# Altium project MS_1_MainBoard.PrjPCB
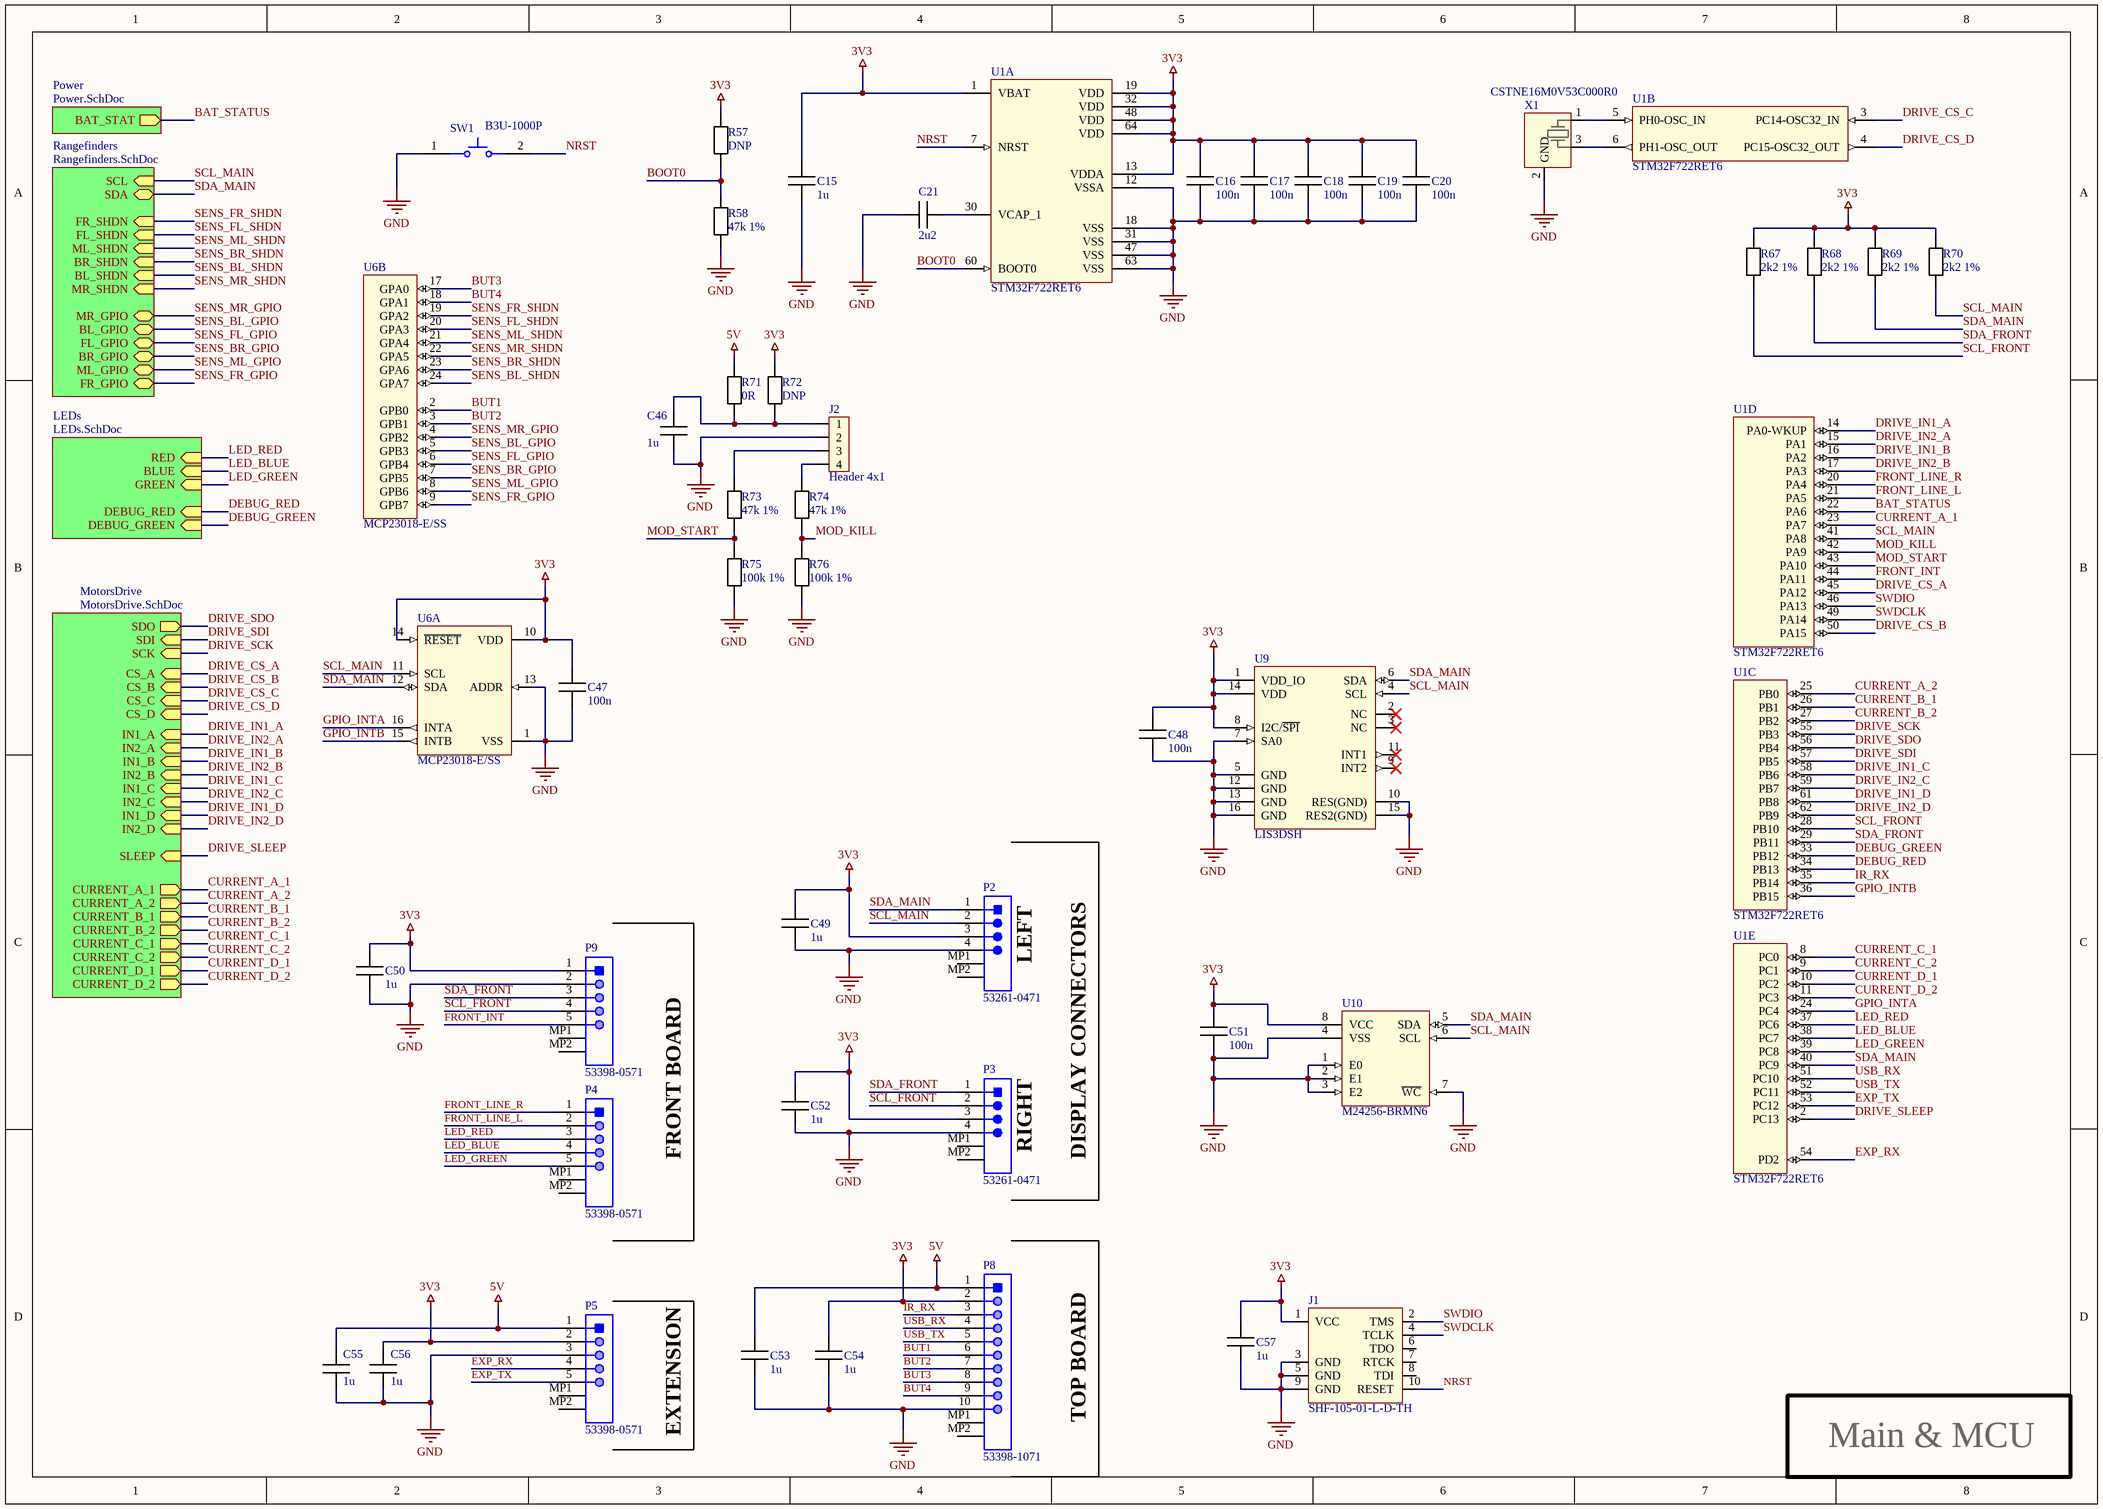
[diagram p0: Main.SchDoc]
6 sheets, 239 parts. Net scope: hierarchical (ports join the sheet entries above them; power ports are global).
Board file: MS_1_MainBoard.PcbDoc
Sheets:
  Main.SchDoc
    Rangefinders = Rangefinders.SchDoc
    Power = Power.SchDoc
    MotorsDrive = MotorsDrive.SchDoc
      VoltageBuffers = VoltageBuffers.SchDoc
    LEDs = LEDs.SchDoc

## Sheet Main.SchDoc: [Untitled]
size A3; Author: Nędzny Janusz; CompanyName: SensDx S.A.; Organization: SensDx S.A.; Address1: Wrocław Laboratories; SheetNumber: 1; SheetTotal: 1

### Parts
C15  1u  [C_0603_AUTO]
C16  100n  [C_0603_AUTO]
C17  100n  [C_0603_AUTO]
C18  100n  [C_0603_AUTO]
C19  100n  [C_0603_AUTO]
C20  100n  [C_0603_AUTO]
C21  2u2  [C_0603_AUTO]
C46  1u  [C_0603_AUTO]
C47  100n  [C_0603_AUTO]
C48  100n  [C_0603_AUTO]
C49  1u  [C_0603_AUTO]
C50  1u  [C_0603_AUTO]
C51  100n  [C_0603_AUTO]
C52  1u  [C_0603_AUTO]
C53  1u  [C_0603_AUTO]
C54  1u  [C_0603_AUTO]
C55  1u  [C_0603_AUTO]
C56  1u  [C_0603_AUTO]
C57  1u  [C_0603_AUTO]
J1  SHF-105-01-L-D-TH  [SHF-105-01-L-D-TH]
J2  Header 4x1  [F_4X1_254]
P2  53261-0471  [MOLEX-53261-0471_V]
P3  53261-0471  [MOLEX-53261-0471_V]
P4  53398-0571  [MOLX-53398-0571-5_V]
P5  53398-0571  [MOLX-53398-0571-5_V]
P8  53398-1071  [MOLX-53398-1071_V]
P9  53398-0571  [MOLX-53398-0571-5_V]
R57  DNP  [R_0603_AUTO]
R58  47k 1%  [R_0603_AUTO]
R67  2k2 1%  [R_0603_AUTO]
R68  2k2 1%  [R_0603_AUTO]
R69  2k2 1%  [R_0603_AUTO]
R70  2k2 1%  [R_0603_AUTO]
R71  0R  [R_0603_AUTO]
R72  DNP  [R_0603_AUTO]
R73  47k 1%  [R_0603_AUTO]
R74  47k 1%  [R_0603_AUTO]
R75  100k 1%  [R_0603_AUTO]
R76  100k 1%  [R_0603_AUTO]
SW1  B3U-1000P  [OMRON-B3U-1000_V]
U1  STM32F722RET6  [LQFP_64_HAND]  (parts A,B,C,D,E of 5)
U6  MCP23018-E/SS  [SSOP-24_HAND]  (parts A,B of 2)
U9  LIS3DSH  [LGA16_AUTO]
U10  M24256-BRMN6  [SOIC_8_AUTO]
X1  CSTNE16M0V53C000R0  [Murata_CSTCE]

### Sub-sheets
LEDs = LEDs.SchDoc: RED (in), BLUE (in), GREEN (in), DEBUG_RED (in), DEBUG_GREEN (in)
MotorsDrive = MotorsDrive.SchDoc: IN1_C (in), IN2_D (in), SLEEP (in), IN2_B (in), IN1_D (in), SDO (out), SCK (in), CS_D (in), SDI (in), CS_C (in), IN2_A (in), IN1_A (in), IN1_B (in), CS_B (in), IN2_C (in), CS_A (in), CURRENT_D_2 (out), CURRENT_D_1 (out), CURRENT_C_1 (out), CURRENT_B_2 (out), CURRENT_C_2 (out), CURRENT_A_2 (out), CURRENT_A_1 (out), CURRENT_B_1 (out)
Power = Power.SchDoc: BAT_STAT (out)
Rangefinders = Rangefinders.SchDoc: FR_SHDN (in), FR_GPIO (bidir), SCL (in), FL_SHDN (in), SDA (bidir), BL_GPIO (bidir), MR_GPIO (bidir), FL_GPIO (bidir), ML_SHDN (in), BR_SHDN (in), BR_GPIO (bidir), BL_SHDN (in), ML_GPIO (bidir), MR_SHDN (in)

### Nets
3V3: C15.2 C16.2 C17.2 C18.2 C19.2 C20.2 C47.2 C48.2 C49.2 C50.2 C51.2 C52.2 C54.2 C56.2 C57.2 J1.1(VCC) P2.3 P3.3 P5.2 P8.2 P9.1 R57.2 R67.2 R68.2 R69.2 R70.2 R72.2 U1.1(VBAT) U1.13(VDDA) U1.19(VDD) U1.32(VDD) U1.48(VDD) U1.64(VDD) U6.10(VDD) U6.14(~{RESET}) U9.1(VDD_IO) U9.8(I2C/~{SPI}) U9.14(VDD) U10.8(VCC)
5V: C53.2 C55.2 P5.1 P8.1 R71.2
GND: C15.1 C16.1 C17.1 C18.1 C19.1 C20.1 C21.2 C46.1 C47.1 C48.1 C49.1 C50.1 C51.1 C52.1 C53.1 C54.1 C55.1 C56.1 C57.1 J1.3(GND) J1.5(GND) J1.9(GND) J2.2 P2.4 P3.4 P5.3 P8.10 P9.2 R58.1 R75.1 R76.1 SW1.1 U1.12(VSSA) U1.18(VSS) U1.31(VSS) U1.47(VSS) U1.63(VSS) U6.1(VSS) U6.13(ADDR) U9.5(GND) U9.7(SA0) U9.10(RES(GND)) U9.12(GND) U9.13(GND) U9.15(RES2(GND)) U9.16(GND) U10.1(E0) U10.2(E1) U10.3(E2) U10.4(VSS) U10.7(~{WC}) X1.2(GND)
BAT_STATUS: U1.22(PA6) ; sheet Power/BAT_STAT
BOOT0: R57.1 R58.2 U1.60(BOOT0)
BUT1: P8.6 U6.2(GPB0)
BUT2: P8.7 U6.3(GPB1)
BUT3: P8.8 U6.17(GPA0)
BUT4: P8.9 U6.18(GPA1)
CURRENT_A_1: U1.23(PA7) ; sheet MotorsDrive/CURRENT_A_1
CURRENT_A_2: U1.25(PB0) ; sheet MotorsDrive/CURRENT_A_2
CURRENT_B_1: U1.26(PB1) ; sheet MotorsDrive/CURRENT_B_1
CURRENT_B_2: U1.27(PB2) ; sheet MotorsDrive/CURRENT_B_2
CURRENT_C_1: U1.8(PC0) ; sheet MotorsDrive/CURRENT_C_1
CURRENT_C_2: U1.9(PC1) ; sheet MotorsDrive/CURRENT_C_2
CURRENT_D_1: U1.10(PC2) ; sheet MotorsDrive/CURRENT_D_1
CURRENT_D_2: U1.11(PC3) ; sheet MotorsDrive/CURRENT_D_2
DEBUG_GREEN: U1.33(PB12) ; sheet LEDs/DEBUG_GREEN
DEBUG_RED: U1.34(PB13) ; sheet LEDs/DEBUG_RED
DRIVE_CS_A: U1.45(PA12) ; sheet MotorsDrive/CS_A
DRIVE_CS_B: U1.50(PA15) ; sheet MotorsDrive/CS_B
DRIVE_CS_C: U1.3(PC14-OSC32_IN) ; sheet MotorsDrive/CS_C
DRIVE_CS_D: U1.4(PC15-OSC32_OUT) ; sheet MotorsDrive/CS_D
DRIVE_IN1_A: U1.14(PA0-WKUP) ; sheet MotorsDrive/IN1_A
DRIVE_IN1_B: U1.16(PA2) ; sheet MotorsDrive/IN1_B
DRIVE_IN1_C: U1.58(PB6) ; sheet MotorsDrive/IN1_C
DRIVE_IN1_D: U1.61(PB8) ; sheet MotorsDrive/IN1_D
DRIVE_IN2_A: U1.15(PA1) ; sheet MotorsDrive/IN2_A
DRIVE_IN2_B: U1.17(PA3) ; sheet MotorsDrive/IN2_B
DRIVE_IN2_C: U1.59(PB7) ; sheet MotorsDrive/IN2_C
DRIVE_IN2_D: U1.62(PB9) ; sheet MotorsDrive/IN2_D
DRIVE_SCK: U1.55(PB3) ; sheet MotorsDrive/SCK
DRIVE_SDI: U1.57(PB5) ; sheet MotorsDrive/SDI
DRIVE_SDO: U1.56(PB4) ; sheet MotorsDrive/SDO
DRIVE_SLEEP: U1.2(PC13) ; sheet MotorsDrive/SLEEP
EXP_RX: P5.4 U1.54(PD2)
EXP_TX: P5.5 U1.53(PC12)
FRONT_INT: P9.5 U1.44(PA11)
FRONT_LINE_L: P4.2 U1.21(PA5)
FRONT_LINE_R: P4.1 U1.20(PA4)
GPIO_INTA: U1.24(PC4) U6.16(INTA)
GPIO_INTB: U1.36(PB15) U6.15(INTB)
IR_RX: P8.3 U1.35(PB14)
LED_BLUE: P4.4 U1.38(PC7) ; sheet LEDs/BLUE
LED_GREEN: P4.5 U1.39(PC8) ; sheet LEDs/GREEN
LED_RED: P4.3 U1.37(PC6) ; sheet LEDs/RED
MOD_KILL: R74.1 R76.2 U1.42(PA9)
MOD_START: R73.1 R75.2 U1.43(PA10)
NRST: J1.10(RESET) SW1.2 U1.7(NRST)
SCL_FRONT: P3.2 P9.4 R67.1 U1.28(PB10)
SCL_MAIN: P2.2 R70.1 U1.41(PA8) U6.11(SCL) U9.4(SCL) U10.6(SCL) ; sheet Rangefinders/SCL  [project net SCL]
SDA_FRONT: P3.1 P9.3 R68.1 U1.29(PB11)
SDA_MAIN: P2.1 R69.1 U1.40(PC9) U6.12(SDA) U9.6(SDA) U10.5(SDA) ; sheet Rangefinders/SDA  [project net SDA]
SENS_BL_GPIO: U6.5(GPB3) ; sheet Rangefinders/BL_GPIO
SENS_BL_SHDN: U6.24(GPA7) ; sheet Rangefinders/BL_SHDN
SENS_BR_GPIO: U6.7(GPB5) ; sheet Rangefinders/BR_GPIO
SENS_BR_SHDN: U6.23(GPA6) ; sheet Rangefinders/BR_SHDN
SENS_FL_GPIO: U6.6(GPB4) ; sheet Rangefinders/FL_GPIO
SENS_FL_SHDN: U6.20(GPA3) ; sheet Rangefinders/FL_SHDN
SENS_FR_GPIO: U6.9(GPB7) ; sheet Rangefinders/FR_GPIO
SENS_FR_SHDN: U6.19(GPA2) ; sheet Rangefinders/FR_SHDN
SENS_ML_GPIO: U6.8(GPB6) ; sheet Rangefinders/ML_GPIO
SENS_ML_SHDN: U6.21(GPA4) ; sheet Rangefinders/ML_SHDN
SENS_MR_GPIO: U6.4(GPB2) ; sheet Rangefinders/MR_GPIO
SENS_MR_SHDN: U6.22(GPA5) ; sheet Rangefinders/MR_SHDN
SWDCLK: J1.4(TCLK) U1.49(PA14)
SWDIO: J1.2(TMS) U1.46(PA13)
USB_RX: P8.4 U1.51(PC10)
USB_TX: P8.5 U1.52(PC11)
NetC21_1: C21.1 U1.30(VCAP_1)
NetC46_2: C46.2 J2.1 R71.1 R72.1
NetJ2_3: J2.3 R73.2
NetJ2_4: J2.4 R74.2
NetU1_5: U1.5(PH0-OSC_IN) X1.1
NetU1_6: U1.6(PH1-OSC_OUT) X1.3

Not connected (* = marked no-connect by the designer): J1 6(TDO) 7(RTCK) 8(TDI); P2 MP1 MP2; P3 MP1 MP2; P4 MP1 MP2; P5 MP1 MP2; P8 MP1 MP2; P9 MP1 MP2; U9 2(NC)* 3(NC)* 9(INT2)* 11(INT1)*

### Notes on the sheet
- (near P2) LEFT
- FRONT BOARD
- (near P3) RIGHT
- DISPLAY CONNECTORS
- EXTENSION
- TOP BOARD
- Main & MCU
- Title
- Size:
- Date:
- A3
- Number:
- Time:
- Revision:
- Sheet
- of
- File:

### Library data of the parts
C15-C21 C46-C57 = Capacitor: Manufacturer: [Generic]; MPN: [Generic]
  C15 C46 C49 C50 C52-C57: Value: 1u
  C16-C20 C47 C48 C51: Value: 100n
  C21: Value: 2u2
J1 = JTAG_ARM_MINI_10_PIN: Standard ARM 20 pin JTAG connector. Angle 90 deg.; Manufacturer: Samtec; Value: NA; MPN: SHF-105-01-L-D-TH; Supplier 1: Farnell; Supplier 2: Mouser; Supplier 3: Digi-Key; Supplier Part Number 1: 2308450; Supplier Part Number 2: 200-SHF10501LDTH; Supplier Part Number 3: SHF-105-01-L-D-TH-ND
J2 = Header 4x1: Manufacturer: NA; Value: NA; MPN: NA
P2 P3 = CMP-2000-05238-1: Male Header, Pitch 1.25 mm, 1 x 4 Position, Height 3.4 mm, -40 to 85 degC, RoHS, Tape and Reel; Current Rating: 1A; Brand: Molex; Number of Positions / Contacts: 4; Pitch: 1.25mm; Voltage Rating: 125V; Mounting Angle: Right; Manufacturer URL: http://www.molex.com/; Factory Pack Quantity: 1000; Housing Material: Thermoplastic; Datasheet URL: http://www.molex.com/pdm_docs/sd/532610471_sd.pdf; Tradename: PicoBlade; Product Type: Headers; Contact Plating: Tin; Contact Material: PhosphorBronze; Package Description: 1.25mm Pitch PicoBlade(TM) Header, Surface Mount, Right Angle, Lead-Free, 4 Circuits; Mounting Style: SMD/SMT; Manufacturer: Molex; Series: 53261; Packaging: Reel; Number of Rows: 1; RoHS: Details; Number of Positions: 4; Product Category: Headers&WireHousings; Datasheet Version: Rev. G, 01/2012; Type: Shrouded; Termination Style: SMD
P4 P5 P9 = CMP-2000-05250-1: Male Header, Pitch 1.25 mm, 1 x 5 Postion, Height 4.7 mm, -40 to 85 degC, RoHS, Tape and Reel; Brand: Molex; Number of Positions: 5Position; Mounting Angle: Vertical; Current Rating: 1A; Pitch: 1.25mm; Voltage Rating: 125V; Type: Shrouded; Tradename: PicoBlade; Datasheet Version: Rev. E, 04/2006; Housing Material: Nylon; Datasheet URL: http://www.molex.com/pdm_docs/sd/533980571_sd.pdf; Termination Style: SMD; Contact Gender: Pin(Male); Factory Pack Quantity: 1000; Number of Rows: 1Row; Product: Headers; Package Reference: MOLX-53398-0571-5; Contact Material: PhosphorBronze; RoHS: Details; Manufacturer URL: http://www.molex.com/; Product Category: Headers&WireHousings; Contact Plating: Tin; Manufacturer: Molex; Series: 53398; Packaging: Reel; Mounting Style: SMD
P8 = CMP-2000-05635-1: Male Header, Pitch 1.25 mm, 1 x 10 Position, Height 4.7 mm, -40 to 85 degC, RoHS, Tape and Reel; Manufacturer: Molex; Mounting Angle: Vertical; Pitch: 1.25mm; Voltage Rating: 125V; Current Rating: 1A; Number of Rows: 1Row; Housing Material: Nylon; Mounting Technology: SurfaceMount; Mounting Style: SMD; Contact Material: PhosphorBronze; Product: Headers; Datasheet URL: http://www.molex.com/pdm_docs/sd/533981071_sd.pdf; Manufacturer URL: http://www.molex.com/; Datasheet Version: Rev. J, 09/2015; Factory Pack Quantity: 1000; Brand: Molex; Packaging: Reel; Product Category: Headers&WireHousings; Contact Gender: Pin(Male); Number of Positions: 10Position; RoHS: Details; Contact Plating: Tin; Package Description: Male Header, Pitch 1.25 mm, 1 x 10 Position, Height 4.7 mm; Series: 53398; Type: Shrouded; Package Reference: 53398-1071; Tradename: PicoBlade; Termination Style: SMD
R57 R58 R67-R76 = Resistor: MPN: [Generic]; Manufacturer: [Generic]
  R57 R72: Value: DNP
  R58 R73 R74: Value: 47k 1%
  R67-R70: Value: 2k2 1%
  R71: Value: 0R
  R75 R76: Value: 100k 1%
SW1 = CMP-2100-03586-1: Ultra-Small Tactile Switch, 0.05 A, 12 V, -25 to 70 degC, 2-Pin SMD, RoHS, Tape and Reel; Manufacturer: Omron Electronic Components; Operating Force: 1.5N; Current Rating: 50mA; Voltage Rating (DC): 12V; Electrical Life: 200000Cycles; Actuator Length: 0.4mm; Insulation Resistance: 100MOhm; Switch Travel: 0.15mm; Throw Configuration: SPST; Illumination Type: Illuminated; Width: 3mm; Weight: 0.022g; Datasheet Version: 42005.0; Datasheet URL: http://www.omron.com/ecb/products/pdf/en-b3u.pdf; Height: 1.2mm; Package Quantity: 1; REACH SVHC: Unknown; Contact Current Rating: 50mA; Contact Material: Silver; Max Current Rating: 50mA; Package Reference: B3U-1000; Termination: SMD/SMT; Packaging: TapeandReel; Manufacturer URL: http://www.omron.com/; RoHSCompliant: true; Mount: SurfaceMount; Length: 4mm; Min Operating Temperature: -25degC; Depth: 2.5mm; Lead Free: LeadFree; Case/Package: SMD/SMT; Package Description: 2-Pin Surface Mount Device, Body 3 x 2.5 mm; Max Operating Temperature: 70degC; Orientation: Straight
U1 = STM32F722RET6: ST 32-bit MCU, 64-pin package; Manufacturer: STMicroelectronics; Value: NA; MPN: STM32F722RET6; ComponentLink1Description: Datasheet; ComponentLink1URL: https://www.st.com/resource/en/datasheet/stm32f722re.pdf; ComponentLink4Description: Product page; ComponentLink4URL: https://www.st.com/en/microcontrollers/stm32f722re.html; Supplier 3: Digi-Key; Supplier 2: Mouser; Supplier 1: Farnell; Supplier Part Number 1: 2725144; Supplier Part Number 2: 511-STM32F722RET6; Supplier Part Number 3: 497-17184-ND
U6 = MCP23018-E/SS: Expander I/O, 16-bit, 3.4 MHz, I2C, 1.8 V, 5.5 V, SSOP24; Manufacturer: Microchip; Value: NA; MPN: MCP23018-E/SS; ComponentLink1Description: Datasheet; ComponentLink1URL: http://ww1.microchip.com/downloads/en/DeviceDoc/22103a.pdf; ComponentLink2Description: Product page; ComponentLink2URL: https://www.microchip.com/wwwproducts/en/MCP23018
U9 = LIS3DSH: MEMS digital output motion sensor: / ultra-low-power high-performance three-axis "nano" accelerometer; Manufacturer: STMicroelectronics; Value: NA; MPN: LIS3DSH; ComponentLink1Description: Datasheet; ComponentLink1URL: https://www.st.com/resource/en/datasheet/lis3dsh.pdf; Supplier 1: Farnell; Supplier 2: Digi-Key; Supplier 3: Mouser; Supplier Part Number 1: 2433078; Supplier Part Number 3: 511-LIS3DSH; Supplier Part Number 2: LIS3DSH-ND
U10 = M24256-BRMN6: 256 Kbit Serial I2C Bus EEPROM; Manufacturer: STMicroelectronics; Value: 256kb; MPN: M24256-BRMN6; ComponentLink1Description: Datasheet; ComponentLink1URL: https://www.st.com/resource/en/datasheet/m24256-br.pdf; Supplier 1: Farnell; Supplier 2: Digi-Key; Supplier 3: Mouser; Supplier Part Number 1: 3130145RL; Supplier Part Number 2: 497-6348-2-ND; Supplier Part Number 3: 511-M24256-BRMN6TP
X1 = CSTNE16M0V53C000R0: 16MHz crystal resonator; Manufacturer: Murata; MPN: CSTNE16M0V53C000R0; Value: 16MHz; ComponentLink1Description: Datasheet; ComponentLink1URL: https://www.murata.com/en-global/products/productdata/8801162166302/SPEC-CSTNE16M0V53C000R0.pdf?1559743213000; Supplier 1: Mouser; Supplier 2: Digi-Key; Supplier Part Number 1: 81-CSTNE16M0V53C000R; Supplier Part Number 2: 490-17949-2-ND

## Sheet Rangefinders.SchDoc: [Untitled]
size A3; Author: Nędzny Janusz; CompanyName: SensDx S.A.; Organization: SensDx S.A.; Address1: Wrocław Laboratories; SheetNumber: 1; SheetTotal: 1
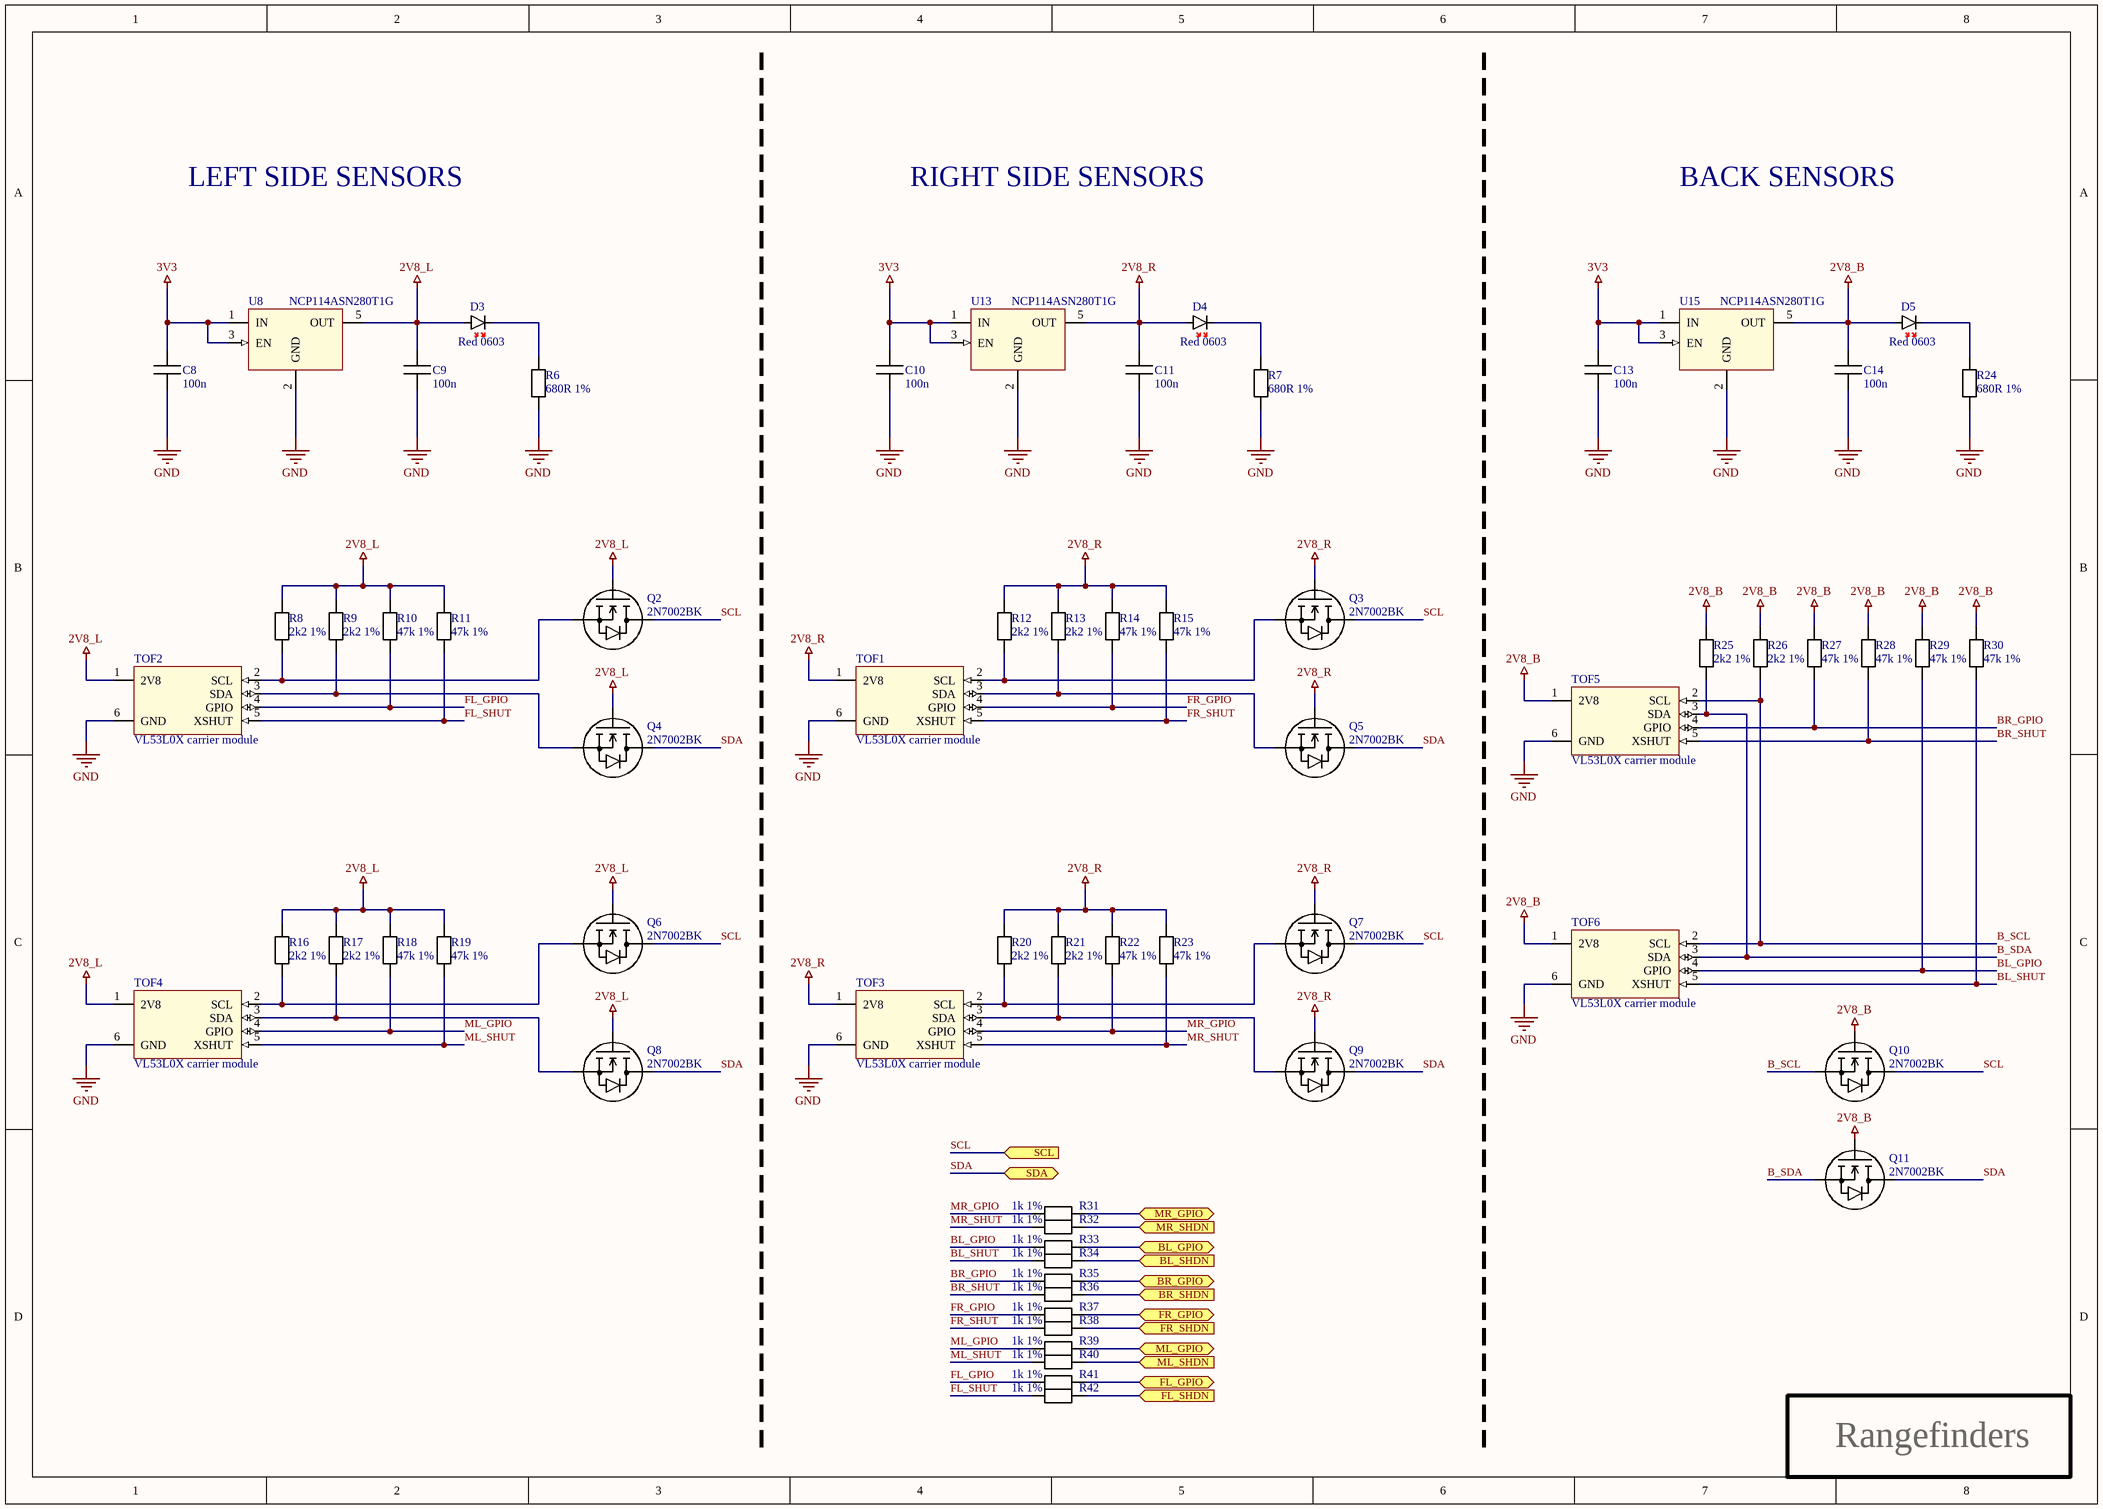
[diagram p1: Rangefinders.SchDoc]

### Parts
C8  100n  [C_0603_AUTO]
C9  100n  [C_0603_AUTO]
C10  100n  [C_0603_AUTO]
C11  100n  [C_0603_AUTO]
C13  100n  [C_0603_AUTO]
C14  100n  [C_0603_AUTO]
D3  Red 0603  [LED_0603_AUTO]
D4  Red 0603  [LED_0603_AUTO]
D5  Red 0603  [LED_0603_AUTO]
Q2  2N7002BK  [SOT23-3_AUTO]
Q3  2N7002BK  [SOT23-3_AUTO]
Q4  2N7002BK  [SOT23-3_AUTO]
Q5  2N7002BK  [SOT23-3_AUTO]
Q6  2N7002BK  [SOT23-3_AUTO]
Q7  2N7002BK  [SOT23-3_AUTO]
Q8  2N7002BK  [SOT23-3_AUTO]
Q9  2N7002BK  [SOT23-3_AUTO]
Q10  2N7002BK  [SOT23-3_AUTO]
Q11  2N7002BK  [SOT23-3_AUTO]
R6  680R 1%  [R_0603_AUTO]
R7  680R 1%  [R_0603_AUTO]
R8  2k2 1%  [R_0603_AUTO]
R9  2k2 1%  [R_0603_AUTO]
R10  47k 1%  [R_0603_AUTO]
R11  47k 1%  [R_0603_AUTO]
R12  2k2 1%  [R_0603_AUTO]
R13  2k2 1%  [R_0603_AUTO]
R14  47k 1%  [R_0603_AUTO]
R15  47k 1%  [R_0603_AUTO]
R16  2k2 1%  [R_0603_AUTO]
R17  2k2 1%  [R_0603_AUTO]
R18  47k 1%  [R_0603_AUTO]
R19  47k 1%  [R_0603_AUTO]
R20  2k2 1%  [R_0603_AUTO]
R21  2k2 1%  [R_0603_AUTO]
R22  47k 1%  [R_0603_AUTO]
R23  47k 1%  [R_0603_AUTO]
R24  680R 1%  [R_0603_AUTO]
R25  2k2 1%  [R_0603_AUTO]
R26  2k2 1%  [R_0603_AUTO]
R27  47k 1%  [R_0603_AUTO]
R28  47k 1%  [R_0603_AUTO]
R29  47k 1%  [R_0603_AUTO]
R30  47k 1%  [R_0603_AUTO]
R31  1k 1%  [R_0603_AUTO]
R32  1k 1%  [R_0603_AUTO]
R33  1k 1%  [R_0603_AUTO]
R34  1k 1%  [R_0603_AUTO]
R35  1k 1%  [R_0603_AUTO]
R36  1k 1%  [R_0603_AUTO]
R37  1k 1%  [R_0603_AUTO]
R38  1k 1%  [R_0603_AUTO]
R39  1k 1%  [R_0603_AUTO]
R40  1k 1%  [R_0603_AUTO]
R41  1k 1%  [R_0603_AUTO]
R42  1k 1%  [R_0603_AUTO]
TOF1  VL53L0X carrier module  [VL53L0X_module]
TOF2  VL53L0X carrier module  [VL53L0X_module]
TOF3  VL53L0X carrier module  [VL53L0X_module]
TOF4  VL53L0X carrier module  [VL53L0X_module]
TOF5  VL53L0X carrier module  [VL53L0X_module]
TOF6  VL53L0X carrier module  [VL53L0X_module]
U8  NCP114ASN280T1G  [TSOP-5_AUTO]
U13  NCP114ASN280T1G  [TSOP-5_AUTO]
U15  NCP114ASN280T1G  [TSOP-5_AUTO]

### Ports
BL_GPIO (bidir), BL_SHDN (in), BR_GPIO (bidir), BR_SHDN (in), FL_GPIO (bidir), FL_SHDN (in), FR_GPIO (bidir), FR_SHDN (in), ML_GPIO (bidir), ML_SHDN (in), MR_GPIO (bidir), MR_SHDN (in), SCL (in), SDA (bidir)

### Nets
2V8_B: C14.2 D5.2(A) Q10.1(G) Q11.1(G) R25.2 R26.2 R27.2 R28.2 R29.2 R30.2 TOF5.1(2V8) TOF6.1(2V8) U15.5(OUT)
2V8_L: C9.2 D3.2(A) Q2.1(G) Q4.1(G) Q6.1(G) Q8.1(G) R8.2 R9.2 R10.2 R11.2 R16.2 R17.2 R18.2 R19.2 TOF2.1(2V8) TOF4.1(2V8) U8.5(OUT)
2V8_R: C11.2 D4.2(A) Q3.1(G) Q5.1(G) Q7.1(G) Q9.1(G) R12.2 R13.2 R14.2 R15.2 R20.2 R21.2 R22.2 R23.2 TOF1.1(2V8) TOF3.1(2V8) U13.5(OUT)
3V3: C8.2 C10.2 C13.2 U8.1(IN) U8.3(EN) U13.1(IN) U13.3(EN) U15.1(IN) U15.3(EN)
GND: C8.1 C9.1 C10.1 C11.1 C13.1 C14.1 R6.1 R7.1 R24.1 TOF1.6(GND) TOF2.6(GND) TOF3.6(GND) TOF4.6(GND) TOF5.6(GND) TOF6.6(GND) U8.2(GND) U13.2(GND) U15.2(GND)
B_SCL: Q10.2(S) R26.1 TOF5.2(SCL) TOF6.2(SCL)
B_SDA: Q11.2(S) R25.1 TOF5.3(SDA) TOF6.3(SDA)
BL_GPIO: R29.1 R33.2 TOF6.4(GPIO)
BL_SHUT: R30.1 R34.2 TOF6.5(XSHUT)
BR_GPIO: R27.1 R35.2 TOF5.4(GPIO)
BR_SHUT: R28.1 R36.2 TOF5.5(XSHUT)
FL_GPIO: R10.1 R41.2 TOF2.4(GPIO)
FL_SHUT: R11.1 R42.2 TOF2.5(XSHUT)
FR_GPIO: R14.1 R37.2 TOF1.4(GPIO)
FR_SHUT: R15.1 R38.2 TOF1.5(XSHUT)
ML_GPIO: R18.1 R39.2 TOF4.4(GPIO)
ML_SHUT: R19.1 R40.2 TOF4.5(XSHUT)
MR_GPIO: R22.1 R31.2 TOF3.4(GPIO)
MR_SHUT: R23.1 R32.2 TOF3.5(XSHUT)
SCL: Q2.3(D) Q3.3(D) Q6.3(D) Q7.3(D) Q10.3(D) ; port SCL
SDA: Q4.3(D) Q5.3(D) Q8.3(D) Q9.3(D) Q11.3(D) ; port SDA
SENS_BL_GPIO: R33.1 ; port BL_GPIO
SENS_BL_SHDN: R34.1 ; port BL_SHDN
SENS_BR_GPIO: R35.1 ; port BR_GPIO
SENS_BR_SHDN: R36.1 ; port BR_SHDN
SENS_FL_GPIO: R41.1 ; port FL_GPIO
SENS_FL_SHDN: R42.1 ; port FL_SHDN
SENS_FR_GPIO: R37.1 ; port FR_GPIO
SENS_FR_SHDN: R38.1 ; port FR_SHDN
SENS_ML_GPIO: R39.1 ; port ML_GPIO
SENS_ML_SHDN: R40.1 ; port ML_SHDN
SENS_MR_GPIO: R31.1 ; port MR_GPIO
SENS_MR_SHDN: R32.1 ; port MR_SHDN
NetD3_1: D3.1(C) R6.2
NetD4_1: D4.1(C) R7.2
NetD5_1: D5.1(C) R24.2
NetQ2_2: Q2.2(S) R8.1 TOF2.2(SCL)
NetQ3_2: Q3.2(S) R12.1 TOF1.2(SCL)
NetQ4_2: Q4.2(S) R9.1 TOF2.3(SDA)
NetQ5_2: Q5.2(S) R13.1 TOF1.3(SDA)
NetQ6_2: Q6.2(S) R16.1 TOF4.2(SCL)
NetQ7_2: Q7.2(S) R20.1 TOF3.2(SCL)
NetQ8_2: Q8.2(S) R17.1 TOF4.3(SDA)
NetQ9_2: Q9.2(S) R21.1 TOF3.3(SDA)

Not connected (* = marked no-connect by the designer): U8 4(NC); U13 4(NC); U15 4(NC)

### Notes on the sheet
- LEFT SIDE SENSORS
- RIGHT SIDE SENSORS
- BACK SENSORS
- Rangefinders
- Title:
- Project name:
- Last modification:
- Author:
- Version control rev.:
- Sheet:
- /
- Sheet size:
- Variant:
- File name:
- A3
- Altium build:

### Library data of the parts
C8-C11 C13 C14 = Capacitor: Manufacturer: [Generic]; MPN: [Generic]; Value: 100n
D3-D5 = LED_Red_0603: Generic Red 0603; MPN: [Generic]; Value: Red; Manufacturer: [Generic]
Q2-Q11 = 2N7002BK: 60 V, 350 mA N-channel Trench MOSFET Vth=1.6V; Manufacturer: Nexperia; Value: NA; MPN: 2N7002BK; ComponentLink1Description: Datasheet; ComponentLink1URL: https://assets.nexperia.com/documents/data-sheet/2N7002BK.pdf; Supplier 1: Mouser; Supplier 2: Digi-Key; Supplier Part Number 1: 771-2N7002BK215; Supplier Part Number 2: 1727-4789-2-ND
R6-R42 = Resistor: MPN: [Generic]; Manufacturer: [Generic]
  R6 R7 R24: Value: 680R 1%
  R8 R9 R12 R13 R16 R17 R20 R21 R25 R26: Value: 2k2 1%
  R10 R11 R14 R15 R18 R19 R22 R23 R27-R30: Value: 47k 1%
  R31-R42: Value: 1k 1%
TOF1-TOF6 = VL53L0X_module: Custom VL53L0X sensor carrier module; Manufacturer: NA; Value: NA; MPN: NA; ComponentLink1Description: Sensor Datasheet; ComponentLink1URL: https://www.st.com/resource/en/datasheet/vl53l0x.pdf; ComponentLink2Description: Sensor product page; ComponentLink2URL: https://www.st.com/en/imaging-and-photonics-solutions/vl53l0x.html
U8 U13 U15 = NCP114ASN280T1G: LDO fixed 2V8 low noise; Manufacturer: ON Semi; Value: NA; MPN: NCP114ASN280T1G; ComponentLink1Description: Datasheet; ComponentLink1URL: http://www.onsemi.com/pub/Collateral/NCP114-D.PDF; Supplier 1: Digi-Key; Supplier 2: Farnell; Supplier 3: Mouser; Supplier Part Number 1: NCP114ASN280T1GOSDKR-ND; Supplier Part Number 3: 863-NCP114ASN280T1G; Supplier Part Number 2: 2677149

## Sheet Power.SchDoc: [Untitled]
size A3; Author: Nędzny Janusz; CompanyName: SensDx S.A.; Organization: SensDx S.A.; Address1: Wrocław Laboratories; SheetNumber: 1; SheetTotal: 1
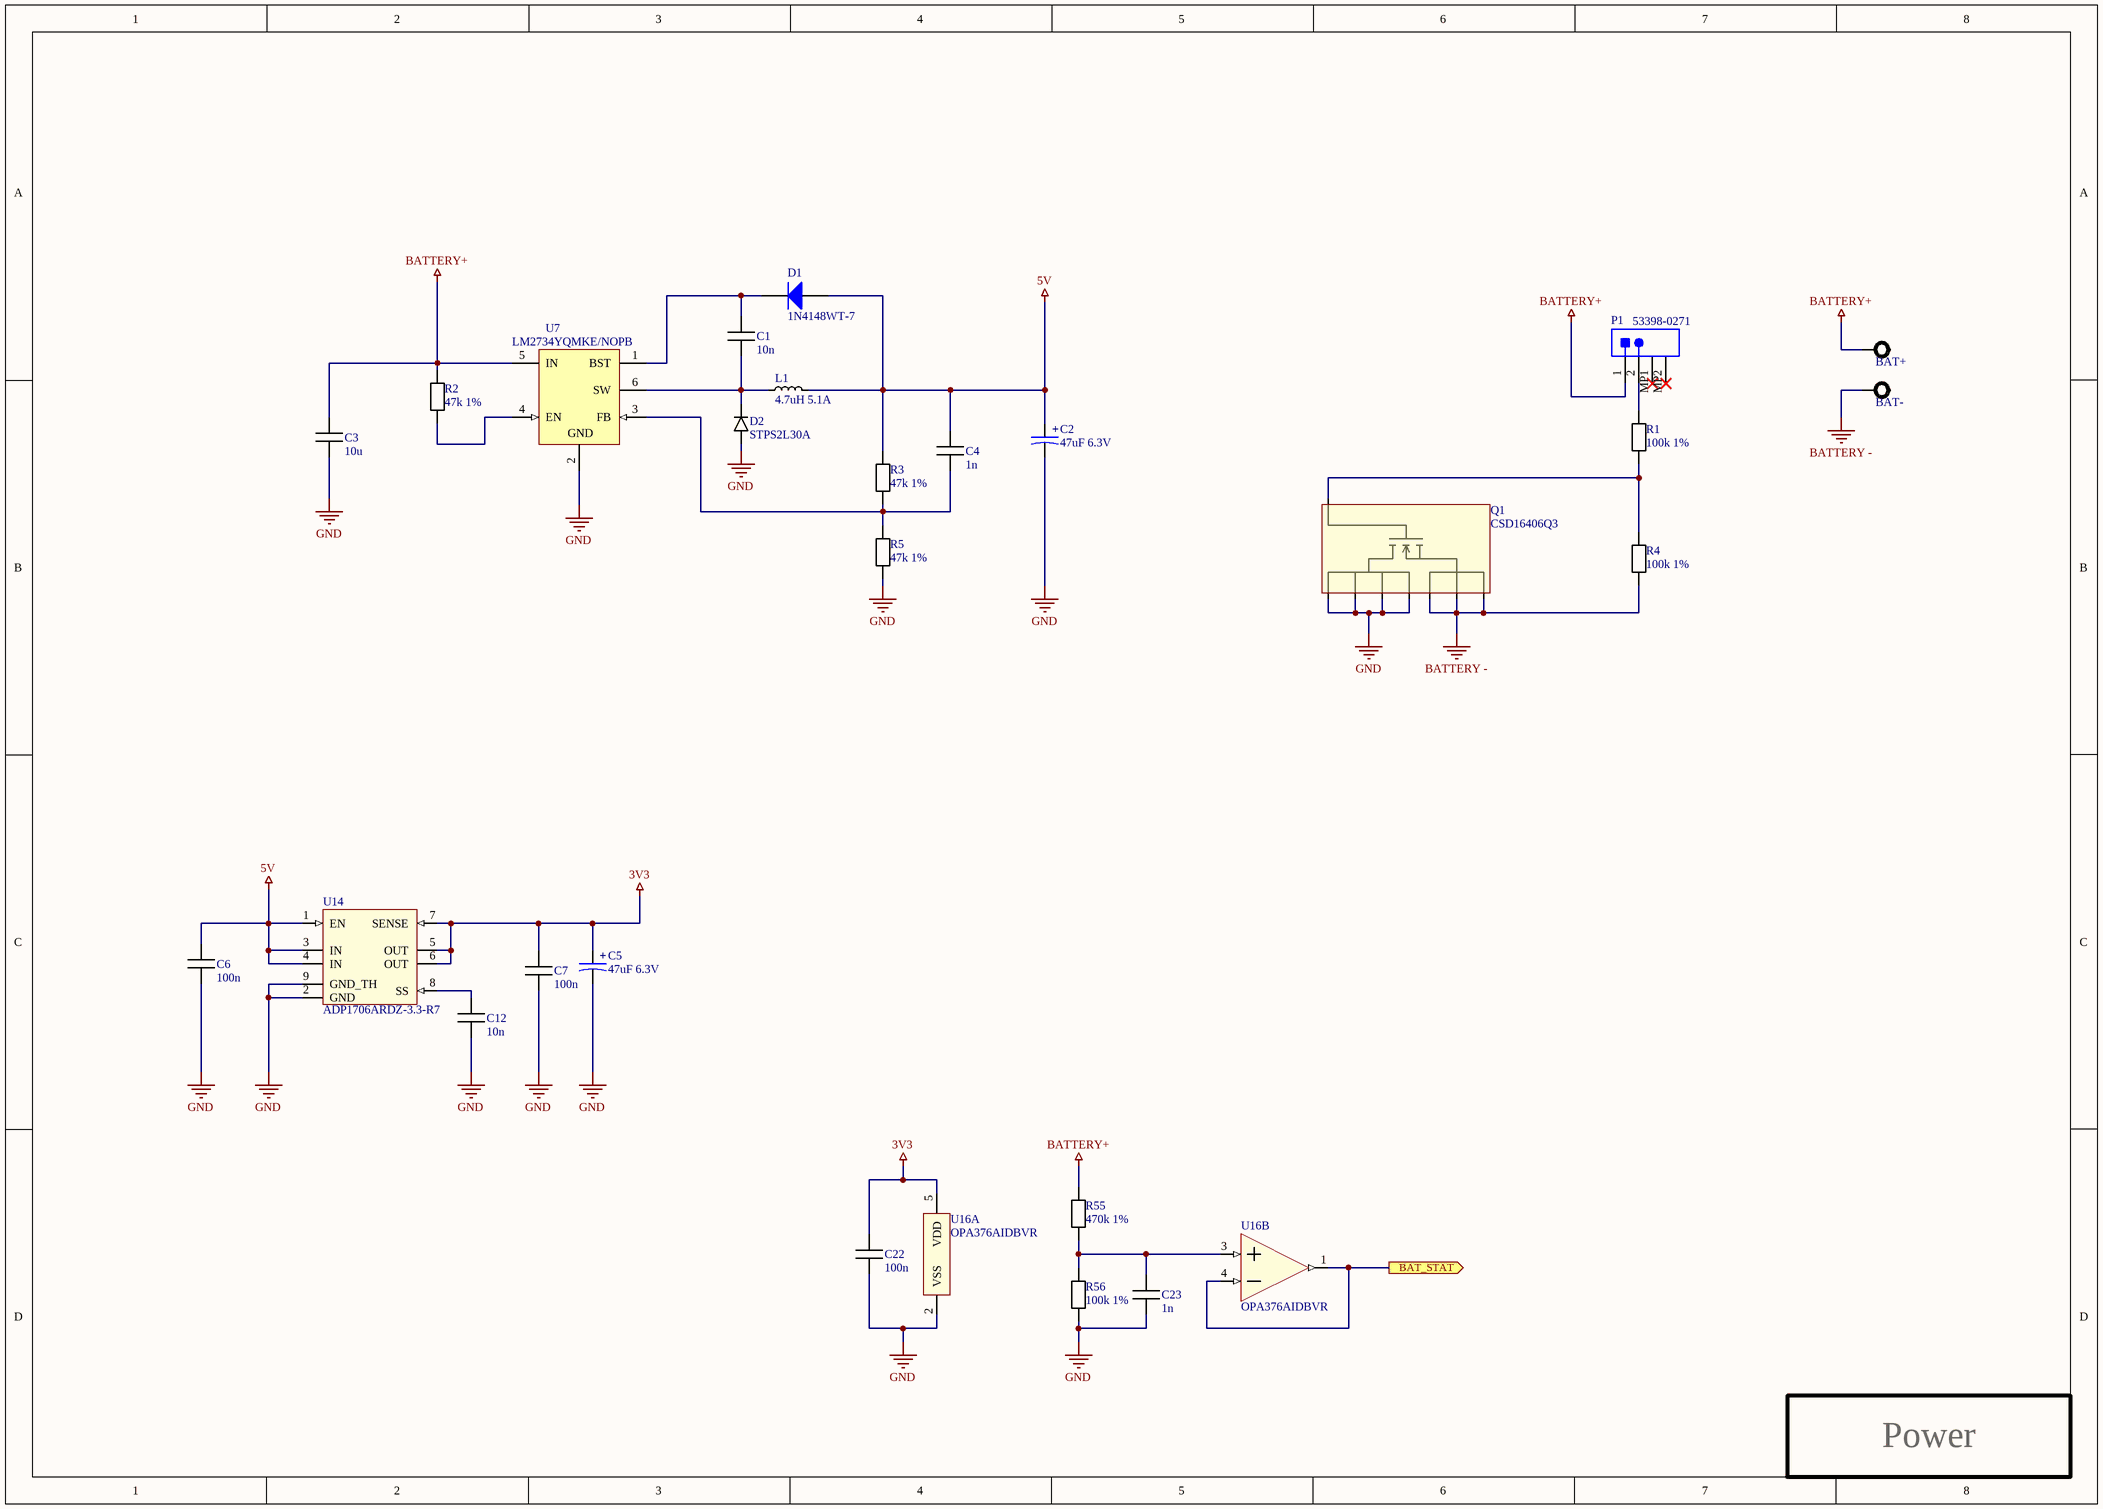
[diagram p2: Power.SchDoc]

### Parts
BAT+  1x2mm  [PAD 1x2mm]  (value not drawn)
BAT-  1x2mm  [PAD 1x2mm]  (value not drawn)
C1  10n  [C_0603_AUTO]
C2  47uF 6.3V  [Kemet_1206]
C3  10u  [C_0805_HAND]
C4  1n  [C_0603_AUTO]
C5  47uF 6.3V  [Kemet_1206]
C6  100n  [C_0603_AUTO]
C7  100n  [C_0603_AUTO]
C12  10n  [C_0603_AUTO]
C22  100n  [C_0603_AUTO]
C23  1n  [C_0603_AUTO]
D1  1N4148WT-7  [DIOD-SOD523-2_V]
D2  STPS2L30A  [SMA]
L1  4.7uH 5.1A  [XAL4030]
P1  53398-0271  [MOLX-53398-0271_V]
Q1  CSD16406Q3  [SON8]
R1  100k 1%  [R_0603_AUTO]
R2  47k 1%  [R_0603_AUTO]
R3  47k 1%  [R_0603_AUTO]
R4  100k 1%  [R_0603_AUTO]
R5  47k 1%  [R_0603_AUTO]
R55  470k 1%  [R_0603_AUTO]
R56  100k 1%  [R_0603_AUTO]
U7  LM2734YQMKE/NOPB  [DDC0006A_L]
U14  ADP1706ARDZ-3.3-R7  [SOIC-8_HAND_THERM]
U16  OPA376AIDBVR  [SOT23-5_AUTO]  (parts A,B of 2)

### Ports
BAT_STAT (out)

### Nets
3V3: C5.1 C7.2 C22.2 U14.5(OUT) U14.6(OUT) U14.7(SENSE) U16.5(VDD)
5V: C2.1 C4.2 C6.2 D1.2(A) L1.2 R3.2 U14.1(EN) U14.3(IN) U14.4(IN)
BATTERY -: BAT-.1 Q1.1(S) Q1.2(S) Q1.3(S) R4.1
BATTERY+: BAT+.1 C3.2 P1.1 R2.2 R55.2 U7.5(IN)
GND: C2.2 C3.1 C5.2 C6.1 C7.1 C12.1 C22.1 C23.1 D2.1(A) Q1.5(S) Q1.6(S) Q1.7(S) Q1.8(S) R5.1 R56.1 U7.2(GND) U14.2(GND) U14.9(GND_TH) U16.2(VSS)
BAT_STATUS: U16.1(OUT) U16.4(IN-) ; port BAT_STAT
NetC1_1: C1.1 D2.2(C) L1.1 U7.6(SW)
NetC1_2: C1.2 D1.1(K) U7.1(BST)
NetC4_1: C4.1 R3.1 R5.2 U7.3(FB)
NetC12_2: C12.2 U14.8(SS)
NetC23_2: C23.2 R55.1 R56.2 U16.3(IN+)
NetP1_2: P1.2 R1.2
NetQ1_4: Q1.4(S) R1.1 R4.2
NetR2_1: R2.1 U7.4(EN)

Not connected (* = marked no-connect by the designer): P1 MP1* MP2*

### Notes on the sheet
- Power
- Title:
- Project name:
- Last modification:
- Author:
- Version control rev.:
- Sheet:
- /
- Sheet size:
- Variant:
- File name:
- A3
- Altium build:
- (in symbol T491A476M006AT) +

### Library data of the parts
BAT+ BAT- = PAD_small: copper pad; Manufacturer: NA; Value: NA; MPN: NA
C1 C3 C4 C6 C7 C12 C22 C23 = Capacitor: Manufacturer: [Generic]; MPN: [Generic]
  C1 C12: Value: 10n
  C3: Value: 10u
  C4 C23: Value: 1n
  C6 C7 C22: Value: 100n
C2 C5 = T491A476M006AT: Tantalum Surface Mount Capacitor, 47 uF, +/- 20%, 6.3 V, -55 to 125 degC, 2-Pin SMD, RoHS, Tape and Reel; Manufacturer: Kemet; Value: 47uF 6.3V; MPN: T491A476M006AT; ComponentLink1Description: Datasheet; ComponentLink1URL: http://www.farnell.com/datasheets/2319567.pdf?_ga=2.178180387.727493313.1541494519-1704470397.1535652464&_gac=1.36309652.1541494519.EAIaIQobChMI6_a5xrK_3gIVxbUYCh3rMw6BEAAYAiAAEgJZGfD_BwE; Supplier 1: Digi-Key; Supplier 2: Mouser; Supplier 3: Farnell; Supplier Part Number 3: 1457429; Supplier Part Number 2: 80-T491A476M06; Supplier Part Number 1: 399-3700-2-ND
D1 = CMP-2000-05518-1: Surface Mount Fast Switching Diode, -65 to 150 degC, 2-Pin SOD523, RoHS, Tape and Reel; Manufacturer: Diodes Inc; Forward Current: 250mA; Diode Configuration: Single; Number of Elements per Chip: 1; Datasheet URL: http://www.diodes.com/_files/datasheets/ds30396.pdf; Pin Count: 2; PartNumber: 1N4148WT; Mounting Type: SurfaceMount; Package Description: 2-Pin Small Outline Diode, Body 1.2 x 0.8 mm; Package URL: http://www.diodes.com/_files/packages/SOD523.pdf; Package Type: SOD-523; Manufacturer URL: http://www.diodes.com/; Datasheet Version: Rev. 16-2, 11/2015; Package Reference: SOD523-2; Mounting Technology: SurfaceMount
D2 = STPS2L30A: Schottky Diodes & Rectifiers 2.0 Amp 30 Volt; Manufacturer: STMicroelectronics; Value: NA; MPN: STPS2L30A; ComponentLink1Description: Datasheet; ComponentLink1URL: https://www.st.com/resource/en/datasheet/stps2l30.pdf; Supplier 1: Digi-Key; Supplier 2: Farnell; Supplier 3: Mouser; Supplier Part Number 2: 1467552; Supplier Part Number 1: 497-3759-2-ND; Supplier Part Number 3: 511-STPS2L30A
L1 = XAL4030-472: Fixed Inductor 4.7uH 20% 5.1A 44.1mOhms; Manufacturer: Coilcraft; Value: 4.7uH 5.1A; MPN: XAL4030-472
P1 = CMP-2000-07600-1: Male Header, Pitch 1.25 mm, 1 x 2 Position, Height 4.7 mm, -40 to 85 degC, RoHS, Tape and Reel; Manufacturer: Molex; Voltage Rating: 125V; Glow Wire Compliant: Non-compliant; Pitch: 1.25mm; Number of Positions: 2; Contact Resistance: 20mOhm; Insulation Resistance: 100MOhm; Current Rating: 1A; Mounting Technology: SurfaceMount; Colour: Natural; Mount: SurfaceMount; Termination: Solder; Packaging: TapeandReel; REACH SVHC: Unknown; Voltage Rating (AC): 125V; Housing Colour: Natural; Manufacturer URL: http://www.molex.com/; Max Operating Temperature: 85degC; Gender: Male; Lead Free: LeadFree; RoHSCompliant: True; Contact Plating: Tin; Package Reference: 53398-0271; Contact Material: Tin; Orientation: Vertical; Datasheet URL: http://www.molex.com/pdm_docs/sd/533980271_sd.pdf; Working Voltage: 125V; Flammability Rating: UL94V-0; Number of Contacts: 2; Package Description: Male Header, Pitch 1.25 mm, 1 x 2 Position, Height 4.7 mm; Datasheet Version: Rev. J, 09/2015; Number of Circuits: 2; Number of Rows: 1; Radiation Hardening: No; Voltage Rating (DC): 125V; Min Operating Temperature: -40degC; Housing Material: Nylon; Package Quantity: 1000
Q1 = CSD16406Q3: N-Channel NexFET™ Power MOSFET; Manufacturer: Texas Instruments; Value: NA; MPN: CSD16406Q3; ComponentLink1Description: Datasheet; ComponentLink1URL: http://www.ti.com/lit/ds/symlink/csd16406q3.pdf; Supplier 1: Digi-Key; Supplier 2: Mouser; Supplier 3: Farnell; Supplier Part Number 1: 296-24251-2-ND; Supplier Part Number 2: 595-CSD16406Q3; Supplier Part Number 3: 2458618
R1-R5 R55 R56 = Resistor: MPN: [Generic]; Manufacturer: [Generic]
  R1 R4 R56: Value: 100k 1%
  R2 R3 R5: Value: 47k 1%
  R55: Value: 470k 1%
U7 = CMP-0063-01059-3: 1A Load Step-Down DC-DC Regulator, 6-pin Tiny SOT23, Pb-Free; Manufacturer: Texas Instruments; PackageTopMarking: SVCB*XTT; PowerWise: N; CompType: MiscPower; Code_IPC: SOT26A-6; RoHS: Y; PackageDescription: Molded TSOT, 2.97 x 1.65 x 0.87mm Body, 6 Lead, 0.95mm Pitch; ComponentLink1URL: http://www.ti.com/general/docs/lit/getliterature.tsp?genericPartNumber=LM2734-Q1&fileType=pdf; PackageReference: DDC0006A; ComponentLink1Description: Datasheet URL; Code_JEDEC: MO-193-AA; PinCount: 6
U14 = ADP1706ARDZ-3.3-R7: LDO 3V3 1A Slow-Start, 450uV RMS noise; Manufacturer: Analog Devices; Value: NA; MPN: ADP1706ARDZ-3.3-R7; Supplier 1: Farnell; Supplier 2: Digi-Key; Supplier 3: Mouser; ComponentLink1Description: Datasheet; ComponentLink1URL: https://www.analog.com/media/en/technical-documentation/data-sheets/ADP1706_1707_1708.pdf; Supplier Part Number 1: 2727463; Supplier Part Number 2: ADP1706ARDZ-3.3-R7TR-ND; Supplier Part Number 3: 584-ADP1706ARDZ3.3R7
U16 = OPA376AIDBVR: OP Amp Single R-R 5-Pin SOT-23 T/R Ultra Low Offset; Manufacturer: Texas Instruments; Value: NA; MPN: OPA376AIDBVR; ComponentLink1Description: Datasheet; ComponentLink1URL: http://www.ti.com/lit/ds/symlink/opa376.pdf

## Sheet MotorsDrive.SchDoc: [Untitled]
size A3; Author: Nędzny Janusz; CompanyName: SensDx S.A.; Organization: SensDx S.A.; Address1: Wrocław Laboratories; SheetNumber: 1; SheetTotal: 1
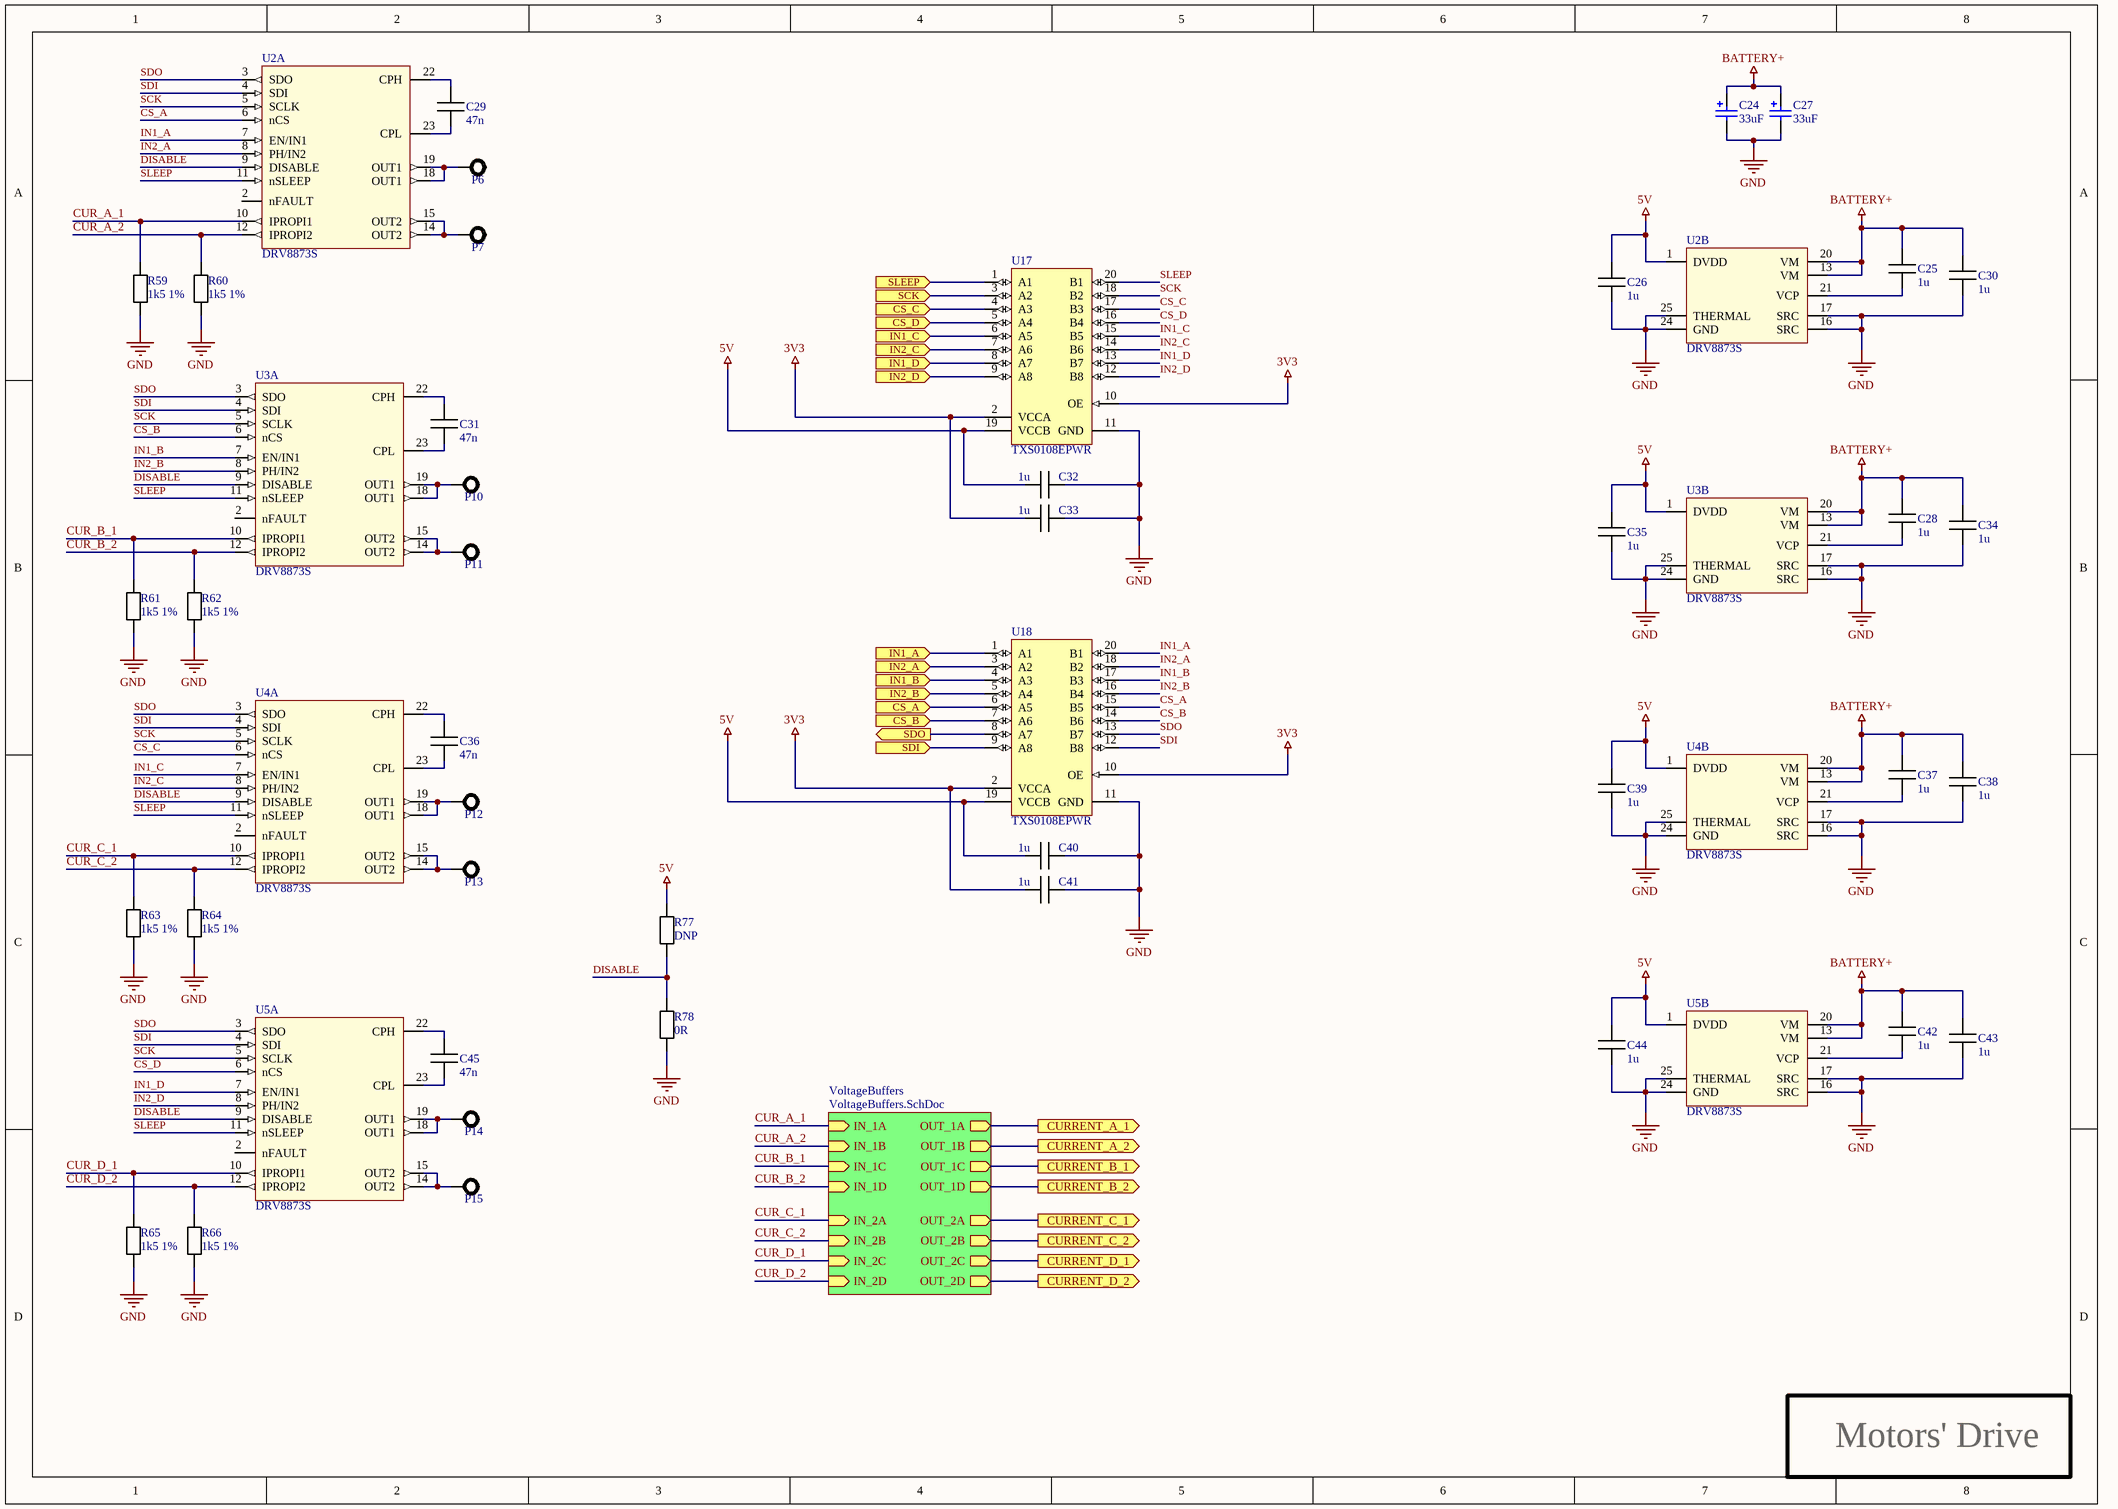
[diagram p3: MotorsDrive.SchDoc]

### Parts
C24  value 33uF  [WCAP-ASLL_6.3x5.5]  (hidden comment: 865060543004)
C25  1u  [C_0603_AUTO]
C26  1u  [C_0603_AUTO]
C27  value 33uF  [WCAP-ASLL_6.3x5.5]  (hidden comment: 865060543004)
C28  1u  [C_0603_AUTO]
C29  47n  [C_0603_AUTO]
C30  1u  [C_0603_AUTO]
C31  47n  [C_0603_AUTO]
C32  1u  [C_0603_AUTO]
C33  1u  [C_0603_AUTO]
C34  1u  [C_0603_AUTO]
C35  1u  [C_0603_AUTO]
C36  47n  [C_0603_AUTO]
C37  1u  [C_0603_AUTO]
C38  1u  [C_0603_AUTO]
C39  1u  [C_0603_AUTO]
C40  1u  [C_0603_AUTO]
C41  1u  [C_0603_AUTO]
C42  1u  [C_0603_AUTO]
C43  1u  [C_0603_AUTO]
C44  1u  [C_0603_AUTO]
C45  47n  [C_0603_AUTO]
P6  1x2mm  [PAD 1x2mm]  (value not drawn)
P7  1x2mm  [PAD 1x2mm]  (value not drawn)
P10  1x2mm  [PAD 1x2mm]  (value not drawn)
P11  1x2mm  [PAD 1x2mm]  (value not drawn)
P12  1x2mm  [PAD 1x2mm]  (value not drawn)
P13  1x2mm  [PAD 1x2mm]  (value not drawn)
P14  1x2mm  [PAD 1x2mm]  (value not drawn)
P15  1x2mm  [PAD 1x2mm]  (value not drawn)
R59  1k5 1%  [R_0603_AUTO]
R60  1k5 1%  [R_0603_AUTO]
R61  1k5 1%  [R_0603_AUTO]
R62  1k5 1%  [R_0603_AUTO]
R63  1k5 1%  [R_0603_AUTO]
R64  1k5 1%  [R_0603_AUTO]
R65  1k5 1%  [R_0603_AUTO]
R66  1k5 1%  [R_0603_AUTO]
R77  DNP  [R_0603_AUTO]
R78  0R  [R_0603_AUTO]
U2  DRV8873S  [SSOP24-TH_HAND]  (parts A,B of 2)
U3  DRV8873S  [SSOP24-TH_HAND]  (parts A,B of 2)
U4  DRV8873S  [SSOP24-TH_HAND]  (parts A,B of 2)
U5  DRV8873S  [SSOP24-TH_HAND]  (parts A,B of 2)
U17  TXS0108EPWR  [PW0020A_M]
U18  TXS0108EPWR  [PW0020A_M]

### Sub-sheets
VoltageBuffers = VoltageBuffers.SchDoc: OUT_1A (out), IN_2A (in), OUT_2D (out), IN_2B (in), OUT_1D (out), IN_1B (in), IN_1C (in), IN_1D (in), OUT_1B (out), OUT_2C (out), OUT_2B (out), IN_2D (in), IN_1A (in), OUT_1C (out), IN_2C (in), OUT_2A (out)

### Ports
CS_A (in), CS_B (in), CS_C (in), CS_D (in), CURRENT_A_1 (out), CURRENT_A_2 (out), CURRENT_B_1 (out), CURRENT_B_2 (out), CURRENT_C_1 (out), CURRENT_C_2 (out), CURRENT_D_1 (out), CURRENT_D_2 (out), IN1_A (in), IN1_B (in), IN1_C (in), IN1_D (in), IN2_A (in), IN2_B (in), IN2_C (in), IN2_D (in), SCK (in), SDI (in), SDO (out), SLEEP (in)

### Nets
3V3: C33.2 C41.2 U17.2(VCCA) U17.10(OE) U18.2(VCCA) U18.10(OE)
5V: C26.2 C32.2 C35.2 C39.2 C40.2 C44.2 R77.2 U2.1(DVDD) U3.1(DVDD) U4.1(DVDD) U5.1(DVDD) U17.19(VCCB) U18.19(VCCB)
BATTERY+: C24.1(P) C25.2 C27.1(P) C28.2 C30.2 C34.2 C37.2 C38.2 C42.2 C43.2 U2.13(VM) U2.20(VM) U3.13(VM) U3.20(VM) U4.13(VM) U4.20(VM) U5.13(VM) U5.20(VM)
GND: C24.2(N) C26.1 C27.2(N) C30.1 C32.1 C33.1 C34.1 C35.1 C38.1 C39.1 C40.1 C41.1 C43.1 C44.1 R59.1 R60.1 R61.1 R62.1 R63.1 R64.1 R65.1 R66.1 R78.1 U2.16(SRC) U2.17(SRC) U2.24(GND) U2.25(THERMAL) U3.16(SRC) U3.17(SRC) U3.24(GND) U3.25(THERMAL) U4.16(SRC) U4.17(SRC) U4.24(GND) U4.25(THERMAL) U5.16(SRC) U5.17(SRC) U5.24(GND) U5.25(THERMAL) U17.11(GND) U18.11(GND)
CS_A: U2.6(nCS) U18.15(B5)
CS_B: U3.6(nCS) U18.14(B6)
CS_C: U4.6(nCS) U17.17(B3)
CS_D: U5.6(nCS) U17.16(B4)
CUR_A_1: R59.2 U2.10(IPROPI1) ; sheet VoltageBuffers/IN_1A
CUR_A_2: R60.2 U2.12(IPROPI2) ; sheet VoltageBuffers/IN_1B
CUR_B_1: R61.2 U3.10(IPROPI1) ; sheet VoltageBuffers/IN_1C
CUR_B_2: R62.2 U3.12(IPROPI2) ; sheet VoltageBuffers/IN_1D
CUR_C_1: R63.2 U4.10(IPROPI1) ; sheet VoltageBuffers/IN_2A
CUR_C_2: R64.2 U4.12(IPROPI2) ; sheet VoltageBuffers/IN_2B
CUR_D_1: R65.2 U5.10(IPROPI1) ; sheet VoltageBuffers/IN_2C
CUR_D_2: R66.2 U5.12(IPROPI2) ; sheet VoltageBuffers/IN_2D
CURRENT_A_1: port CURRENT_A_1, sheet VoltageBuffers/OUT_1A
CURRENT_A_2: port CURRENT_A_2, sheet VoltageBuffers/OUT_1B
CURRENT_B_1: port CURRENT_B_1, sheet VoltageBuffers/OUT_1C
CURRENT_B_2: port CURRENT_B_2, sheet VoltageBuffers/OUT_1D
CURRENT_C_1: port CURRENT_C_1, sheet VoltageBuffers/OUT_2A
CURRENT_C_2: port CURRENT_C_2, sheet VoltageBuffers/OUT_2B
CURRENT_D_1: port CURRENT_D_1, sheet VoltageBuffers/OUT_2C
CURRENT_D_2: port CURRENT_D_2, sheet VoltageBuffers/OUT_2D
DISABLE: R77.1 R78.2 U2.9(DISABLE) U3.9(DISABLE) U4.9(DISABLE) U5.9(DISABLE)
DRIVE_CS_A: U18.6(A5) ; port CS_A
DRIVE_CS_B: U18.7(A6) ; port CS_B
DRIVE_CS_C: U17.4(A3) ; port CS_C
DRIVE_CS_D: U17.5(A4) ; port CS_D
DRIVE_IN1_A: U18.1(A1) ; port IN1_A
DRIVE_IN1_B: U18.4(A3) ; port IN1_B
DRIVE_IN1_C: U17.6(A5) ; port IN1_C
DRIVE_IN1_D: U17.8(A7) ; port IN1_D
DRIVE_IN2_A: U18.3(A2) ; port IN2_A
DRIVE_IN2_B: U18.5(A4) ; port IN2_B
DRIVE_IN2_C: U17.7(A6) ; port IN2_C
DRIVE_IN2_D: U17.9(A8) ; port IN2_D
DRIVE_SCK: U17.3(A2) ; port SCK
DRIVE_SDI: U18.9(A8) ; port SDI
DRIVE_SDO: U18.8(A7) ; port SDO
DRIVE_SLEEP: U17.1(A1) ; port SLEEP
IN1_A: U2.7(EN/IN1) U18.20(B1)
IN1_B: U3.7(EN/IN1) U18.17(B3)
IN1_C: U4.7(EN/IN1) U17.15(B5)
IN1_D: U5.7(EN/IN1) U17.13(B7)
IN2_A: U2.8(PH/IN2) U18.18(B2)
IN2_B: U3.8(PH/IN2) U18.16(B4)
IN2_C: U4.8(PH/IN2) U17.14(B6)
IN2_D: U5.8(PH/IN2) U17.12(B8)
SCK: U2.5(SCLK) U3.5(SCLK) U4.5(SCLK) U5.5(SCLK) U17.18(B2)
SDI: U2.4(SDI) U3.4(SDI) U4.4(SDI) U5.4(SDI) U18.12(B8)
SDO: U2.3(SDO) U3.3(SDO) U4.3(SDO) U5.3(SDO) U18.13(B7)
SLEEP: U2.11(nSLEEP) U3.11(nSLEEP) U4.11(nSLEEP) U5.11(nSLEEP) U17.20(B1)
NetC25_1: C25.1 U2.21(VCP)
NetC28_1: C28.1 U3.21(VCP)
NetC29_1: C29.1 U2.23(CPL)
NetC29_2: C29.2 U2.22(CPH)
NetC31_1: C31.1 U3.23(CPL)
NetC31_2: C31.2 U3.22(CPH)
NetC36_1: C36.1 U4.23(CPL)
NetC36_2: C36.2 U4.22(CPH)
NetC37_1: C37.1 U4.21(VCP)
NetC42_1: C42.1 U5.21(VCP)
NetC45_1: C45.1 U5.23(CPL)
NetC45_2: C45.2 U5.22(CPH)
NetP6_1: P6.1 U2.18(OUT1) U2.19(OUT1)
NetP7_1: P7.1 U2.14(OUT2) U2.15(OUT2)
NetP10_1: P10.1 U3.18(OUT1) U3.19(OUT1)
NetP11_1: P11.1 U3.14(OUT2) U3.15(OUT2)
NetP12_1: P12.1 U4.18(OUT1) U4.19(OUT1)
NetP13_1: P13.1 U4.14(OUT2) U4.15(OUT2)
NetP14_1: P14.1 U5.18(OUT1) U5.19(OUT1)
NetP15_1: P15.1 U5.14(OUT2) U5.15(OUT2)

Not connected (* = marked no-connect by the designer): U2 2(nFAULT); U3 2(nFAULT); U4 2(nFAULT); U5 2(nFAULT)

### Notes on the sheet
- Motors' Drive
- Title:
- Project name:
- Last modification:
- Author:
- Version control rev.:
- Sheet:
- /
- Sheet size:
- Variant:
- File name:
- A3
- Altium build:

### Library data of the parts
C24 C27 = 865060543004: WCAP-ASLL Aluminum Electrolytic Capacitors, size Ф6.3x5.5mm, 35V DC, 33uF; Rated Voltage: 35V DC; ComponentLink1Description: Manufacturer; ComponentLink1URL: http://www.we-online.de; ComponentLink2Description: Datasheet; ComponentLink2URL: http://katalog.we-online.de/pbs/datasheet/865060543004.pdf; Part Number: 865060543004; Published Date: June 2017; Publisher: Wurth Elektronik; Size: Ф6.3x5.5mm; Life Cycle: 2000h; Operating Temperature: -55 °C up to +105 °C
C25 C26 C28-C45 = Capacitor: Manufacturer: [Generic]; MPN: [Generic]
  C25 C26 C28 C30 C32-C35 C37-C44: Value: 1u
  C29 C31 C36 C45: Value: 47n
P6 P7 P10-P15 = PAD_small: copper pad; Manufacturer: NA; Value: NA; MPN: NA
R59-R66 R77 R78 = Resistor: MPN: [Generic]; Manufacturer: [Generic]
  R59-R66: Value: 1k5 1%
  R77: Value: DNP
  R78: Value: 0R
U2-U5 = DRV8873S: 10A H-Bridge Motor Driver with Integrated Current Sensing and Current Sense Output; Manufacturer: Texas Instruments; Value: NA; MPN: DRV8873S; ComponentLink1Description: Datasheet; ComponentLink1URL: http://www.ti.com/lit/ds/symlink/drv8873.pdf; ComponentLink2Description: Product page; ComponentLink2URL: http://www.ti.com/product/DRV8873; Supplier 1: Digi-Key; Supplier 2: Mouser; Supplier Part Number 2: 595-DRV8873SPWPRQ1; Supplier Part Number 1: 296-50275-6-ND
U17 U18 = CMP-2000-04956-1: Bidirectional Voltage-Level Translator for Open-Drain and Push-Pull Application, 8 bit, 1.2 to 3.6 V, -40 to 85 degC, 20-Pin TSSOP, Green (RoHS & no Sb/Br), Tape and Reel; Manufacturer: Texas Instruments; Logic Type: VoltageLevelTranslator; Output Current: 620µA; Propagation Delay: 4.8ns; Supply Voltage Min: 1.2V; No. of Inputs: 8; Supply Voltage Max: 5.5V; SVHC: NoSVHC(16-Jun-2014); No. of Pins: 20; Datasheet URL: https://datasheet.ciiva.com/14287/txs0108e-14287280.pdf; Operating Temperature Min: -40degC; Logic Case Style: TSSOP; Packaging: CutTape; Datasheet Version: Rev. B, 09/2008; MSL: MSL1-Unlimited; Manufacturer URL: http://www.ti.com/; Operating Temperature Max: 85degC

## Sheet VoltageBuffers.SchDoc: [Untitled]
size A3; Author: Nędzny Janusz; CompanyName: SensDx S.A.; Organization: SensDx S.A.; Address1: Wrocław Laboratories; SheetNumber: 1; SheetTotal: 1
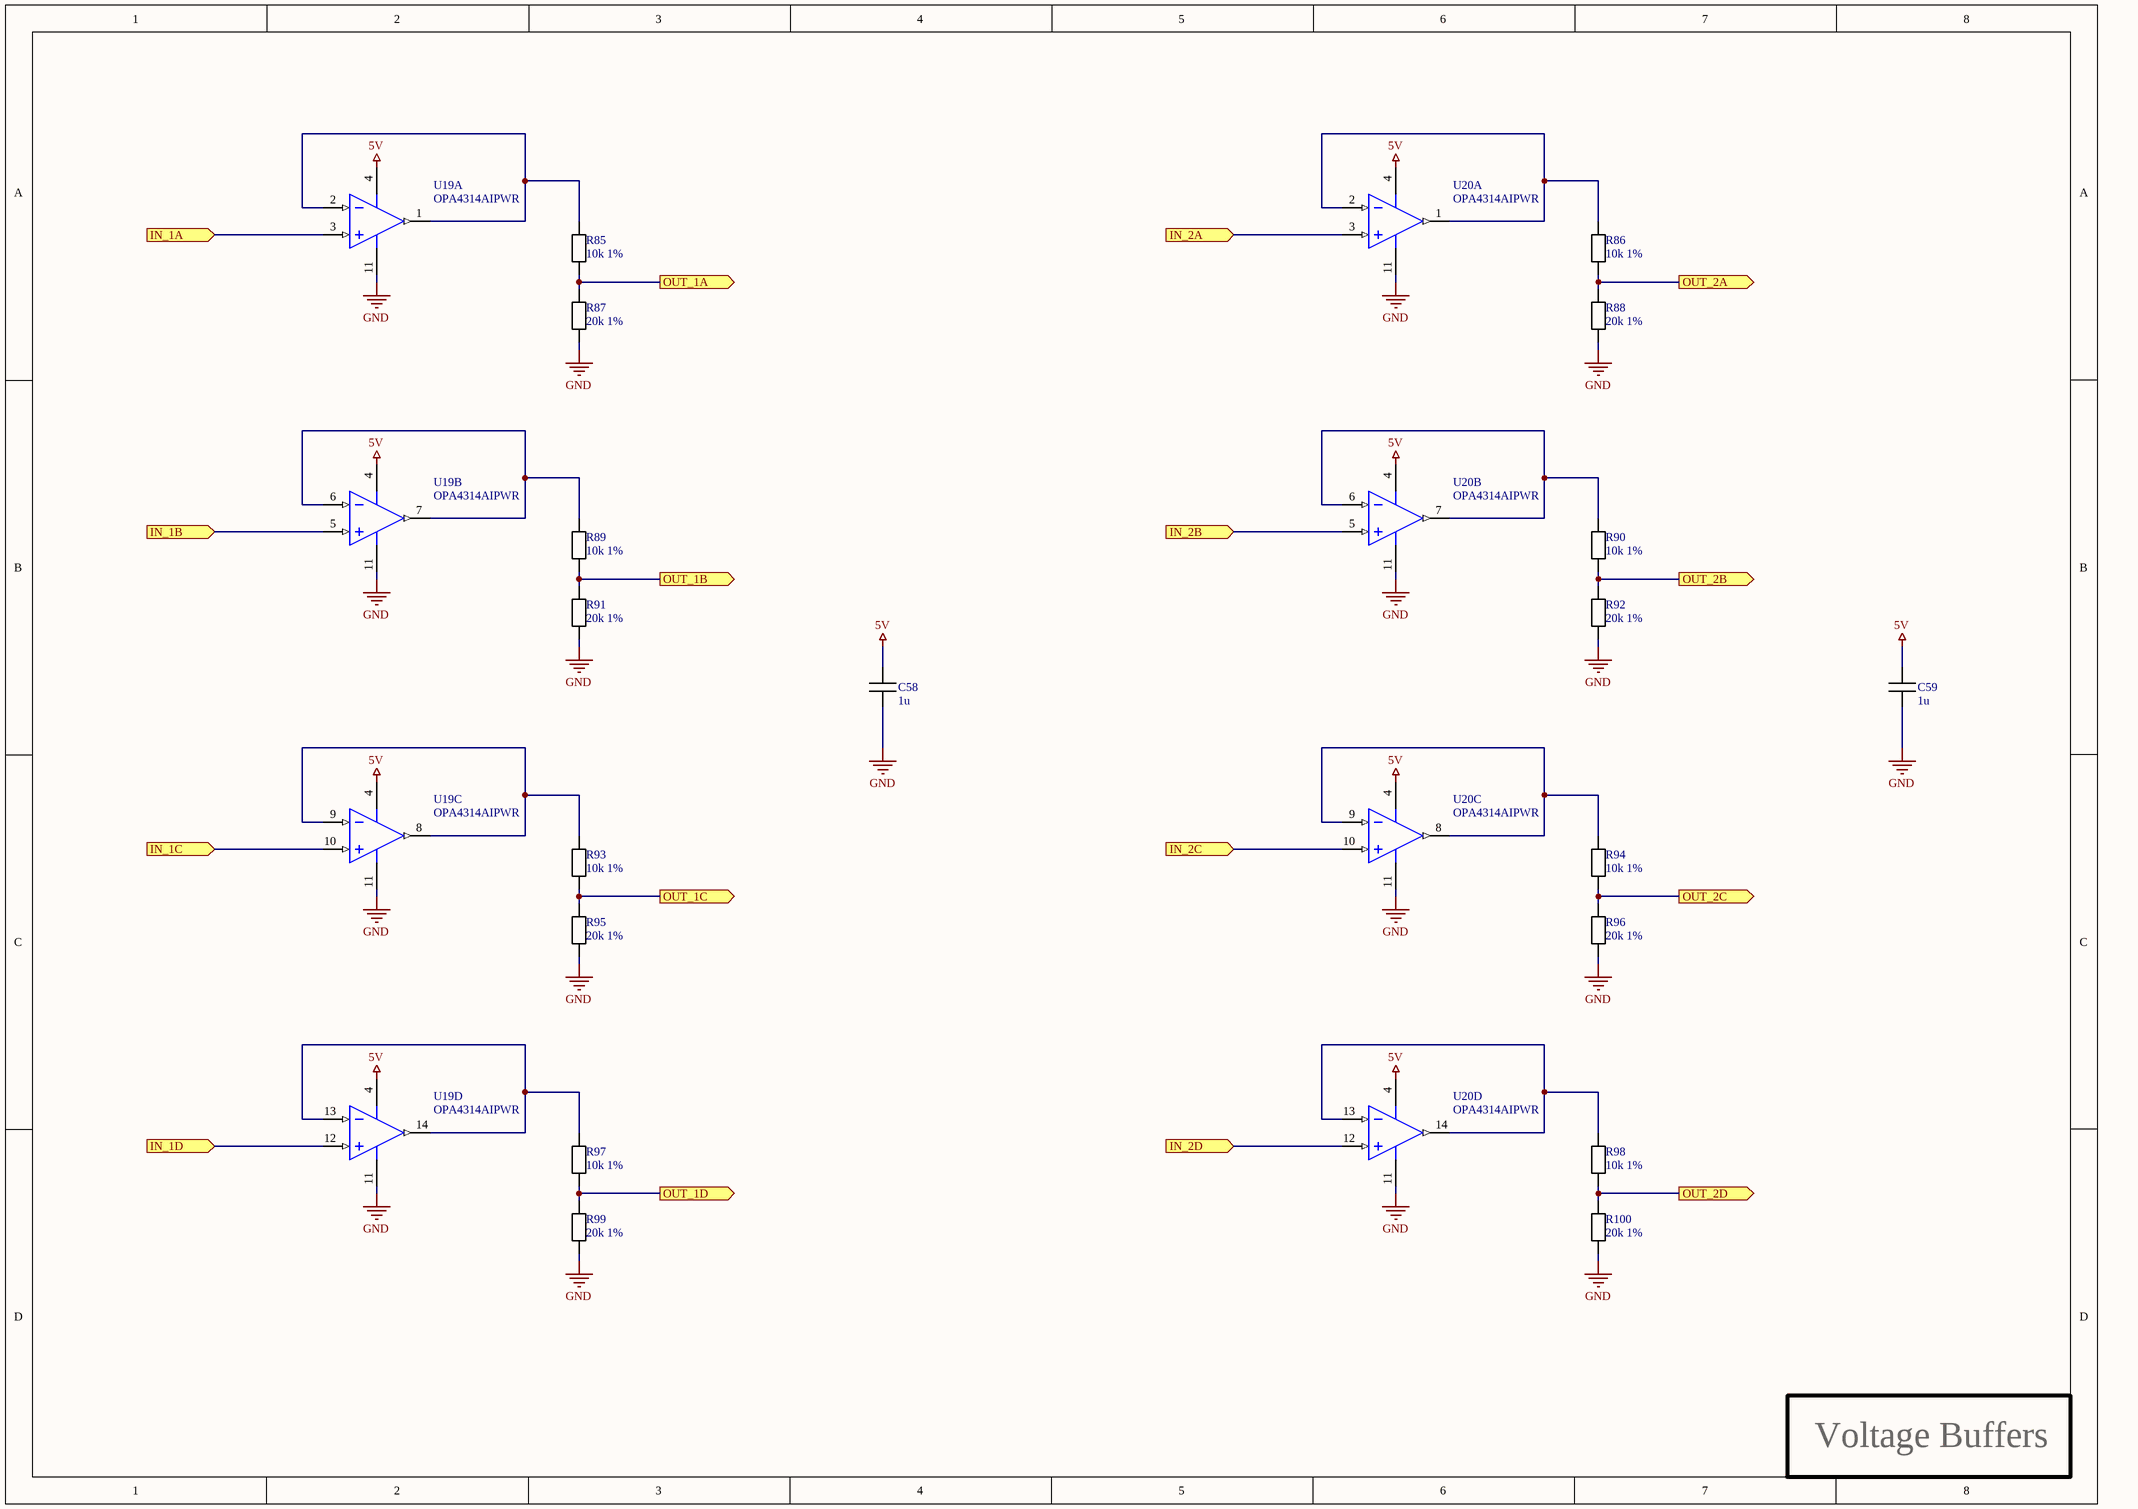
[diagram p4: VoltageBuffers.SchDoc]

### Parts
C58  1u  [C_0603_AUTO]
C59  1u  [C_0603_AUTO]
R85  10k 1%  [R_0603_AUTO]
R86  10k 1%  [R_0603_AUTO]
R87  20k 1%  [R_0603_AUTO]
R88  20k 1%  [R_0603_AUTO]
R89  10k 1%  [R_0603_AUTO]
R90  10k 1%  [R_0603_AUTO]
R91  20k 1%  [R_0603_AUTO]
R92  20k 1%  [R_0603_AUTO]
R93  10k 1%  [R_0603_AUTO]
R94  10k 1%  [R_0603_AUTO]
R95  20k 1%  [R_0603_AUTO]
R96  20k 1%  [R_0603_AUTO]
R97  10k 1%  [R_0603_AUTO]
R98  10k 1%  [R_0603_AUTO]
R99  20k 1%  [R_0603_AUTO]
R100  20k 1%  [R_0603_AUTO]
U19  OPA4314AIPWR  [PW0014A_N]  (parts A,B,C,D of 4)
U20  OPA4314AIPWR  [PW0014A_N]  (parts A,B,C,D of 4)

### Ports
IN_1A (in), IN_1B (in), IN_1C (in), IN_1D (in), IN_2A (in), IN_2B (in), IN_2C (in), IN_2D (in), OUT_1A (out), OUT_1B (out), OUT_1C (out), OUT_1D (out), OUT_2A (out), OUT_2B (out), OUT_2C (out), OUT_2D (out)

### Nets
5V: C58.2 C59.2 U19.4(V+) U20.4(V+)
GND: C58.1 C59.1 R87.1 R88.1 R91.1 R92.1 R95.1 R96.1 R99.1 R100.1 U19.11(V-) U20.11(V-)
CUR_A_1: U19.3(IN_A+) ; port IN_1A
CUR_A_2: U19.5(IN_B+) ; port IN_1B
CUR_B_1: U19.10(IN_C+) ; port IN_1C
CUR_B_2: U19.12(IN_D+) ; port IN_1D
CUR_C_1: U20.3(IN_A+) ; port IN_2A
CUR_C_2: U20.5(IN_B+) ; port IN_2B
CUR_D_1: U20.10(IN_C+) ; port IN_2C
CUR_D_2: U20.12(IN_D+) ; port IN_2D
CURRENT_A_1: R85.1 R87.2 ; port OUT_1A
CURRENT_A_2: R89.1 R91.2 ; port OUT_1B
CURRENT_B_1: R93.1 R95.2 ; port OUT_1C
CURRENT_B_2: R97.1 R99.2 ; port OUT_1D
CURRENT_C_1: R86.1 R88.2 ; port OUT_2A
CURRENT_C_2: R90.1 R92.2 ; port OUT_2B
CURRENT_D_1: R94.1 R96.2 ; port OUT_2C
CURRENT_D_2: R98.1 R100.2 ; port OUT_2D
NetR85_2: R85.2 U19.1(OUT_A) U19.2(IN_A-)
NetR86_2: R86.2 U20.1(OUT_A) U20.2(IN_A-)
NetR89_2: R89.2 U19.6(IN_B-) U19.7(OUT_B)
NetR90_2: R90.2 U20.6(IN_B-) U20.7(OUT_B)
NetR93_2: R93.2 U19.8(OUT_C) U19.9(IN_C-)
NetR94_2: R94.2 U20.8(OUT_C) U20.9(IN_C-)
NetR97_2: R97.2 U19.13(IN_D-) U19.14(OUT_D)
NetR98_2: R98.2 U20.13(IN_D-) U20.14(OUT_D)

### Notes on the sheet
- Voltage Buffers
- Title:
- Project name:
- Last modification:
- Author:
- Version control rev.:
- Sheet:
- /
- Sheet size:
- Variant:
- File name:
- A3
- Altium build:

### Library data of the parts
C58 C59 = Capacitor: Manufacturer: [Generic]; MPN: [Generic]; Value: 1u
R85-R100 = Resistor: MPN: [Generic]; Manufacturer: [Generic]
  R85 R86 R89 R90 R93 R94 R97 R98: Value: 10k 1%
  R87 R88 R91 R92 R95 R96 R99 R100: Value: 20k 1%
U19 U20 = CMP-0272-01740-3: Quad 3 MHz, Low-Power, Low-Noise, RRI/O, CMOS Operational Amplifier, 1.8 to 5.5 V, -40 to 125 degC, 14-pin SOP (PW14), Green (RoHS & no Sb/Br); Manufacturer: Texas Instruments; Rating: Catalog; CMRR(Min)(dB): 75; Total Supply Voltage(Max)(+5V is 5, +/-5V is 10): 5.5; GBW(Typ)(MHz): 3; Packing: LARGE T&R; Vio (25C)(Max)(mV): 2.5; Number of Channels: 4; IIB(Max)(pA): 10; Iq per channel(Max)(mA): 0.19; Slew Rate(Typ)(V/us): 1.5; Offset Drift(Typ)(uV/C): 1; Total Supply Voltage(Min)(+5V is 5, +/-5V is 10): 1.8; Sub Family: Low Input Bias Current Amp (<=10pA), Low Power Amp (<=500uA), Low Supply Voltage Amplifier (<=2.7V), Precision Amplifier; ComponentLink2URL: http://www.ti.com/lit/ds/symlink/opa4314.pdf; Code_JEDEC: MO-153; PackageDescription: 14-Pin Plastic Small Outline, Body 5 x 4.4 mm, Pitch 0.65 mm; Eco-Plan: Green (RoHS & no Sb/Br); ComponentLink3Description: Package Specification; DatasheetVersion: SBOS563E; ComponentLink2Description: Datasheet; Mounting Technology: Surface Mount; PackageReference: PW0014A; ComponentLink1Description: Manufacturer URL; ComponentLink3URL: http://www.ti.com/litv/pdf/mpds360; ComponentLink1URL: http://www.ti.com/; PackageVersion: 4040064-3/G, 02/2011; PartNumber: OPA4314AIPWR

## Sheet LEDs.SchDoc: [Untitled]
size A3; Author: Nędzny Janusz; CompanyName: SensDx S.A.; Organization: SensDx S.A.; Address1: Wrocław Laboratories; SheetNumber: 1; SheetTotal: 1
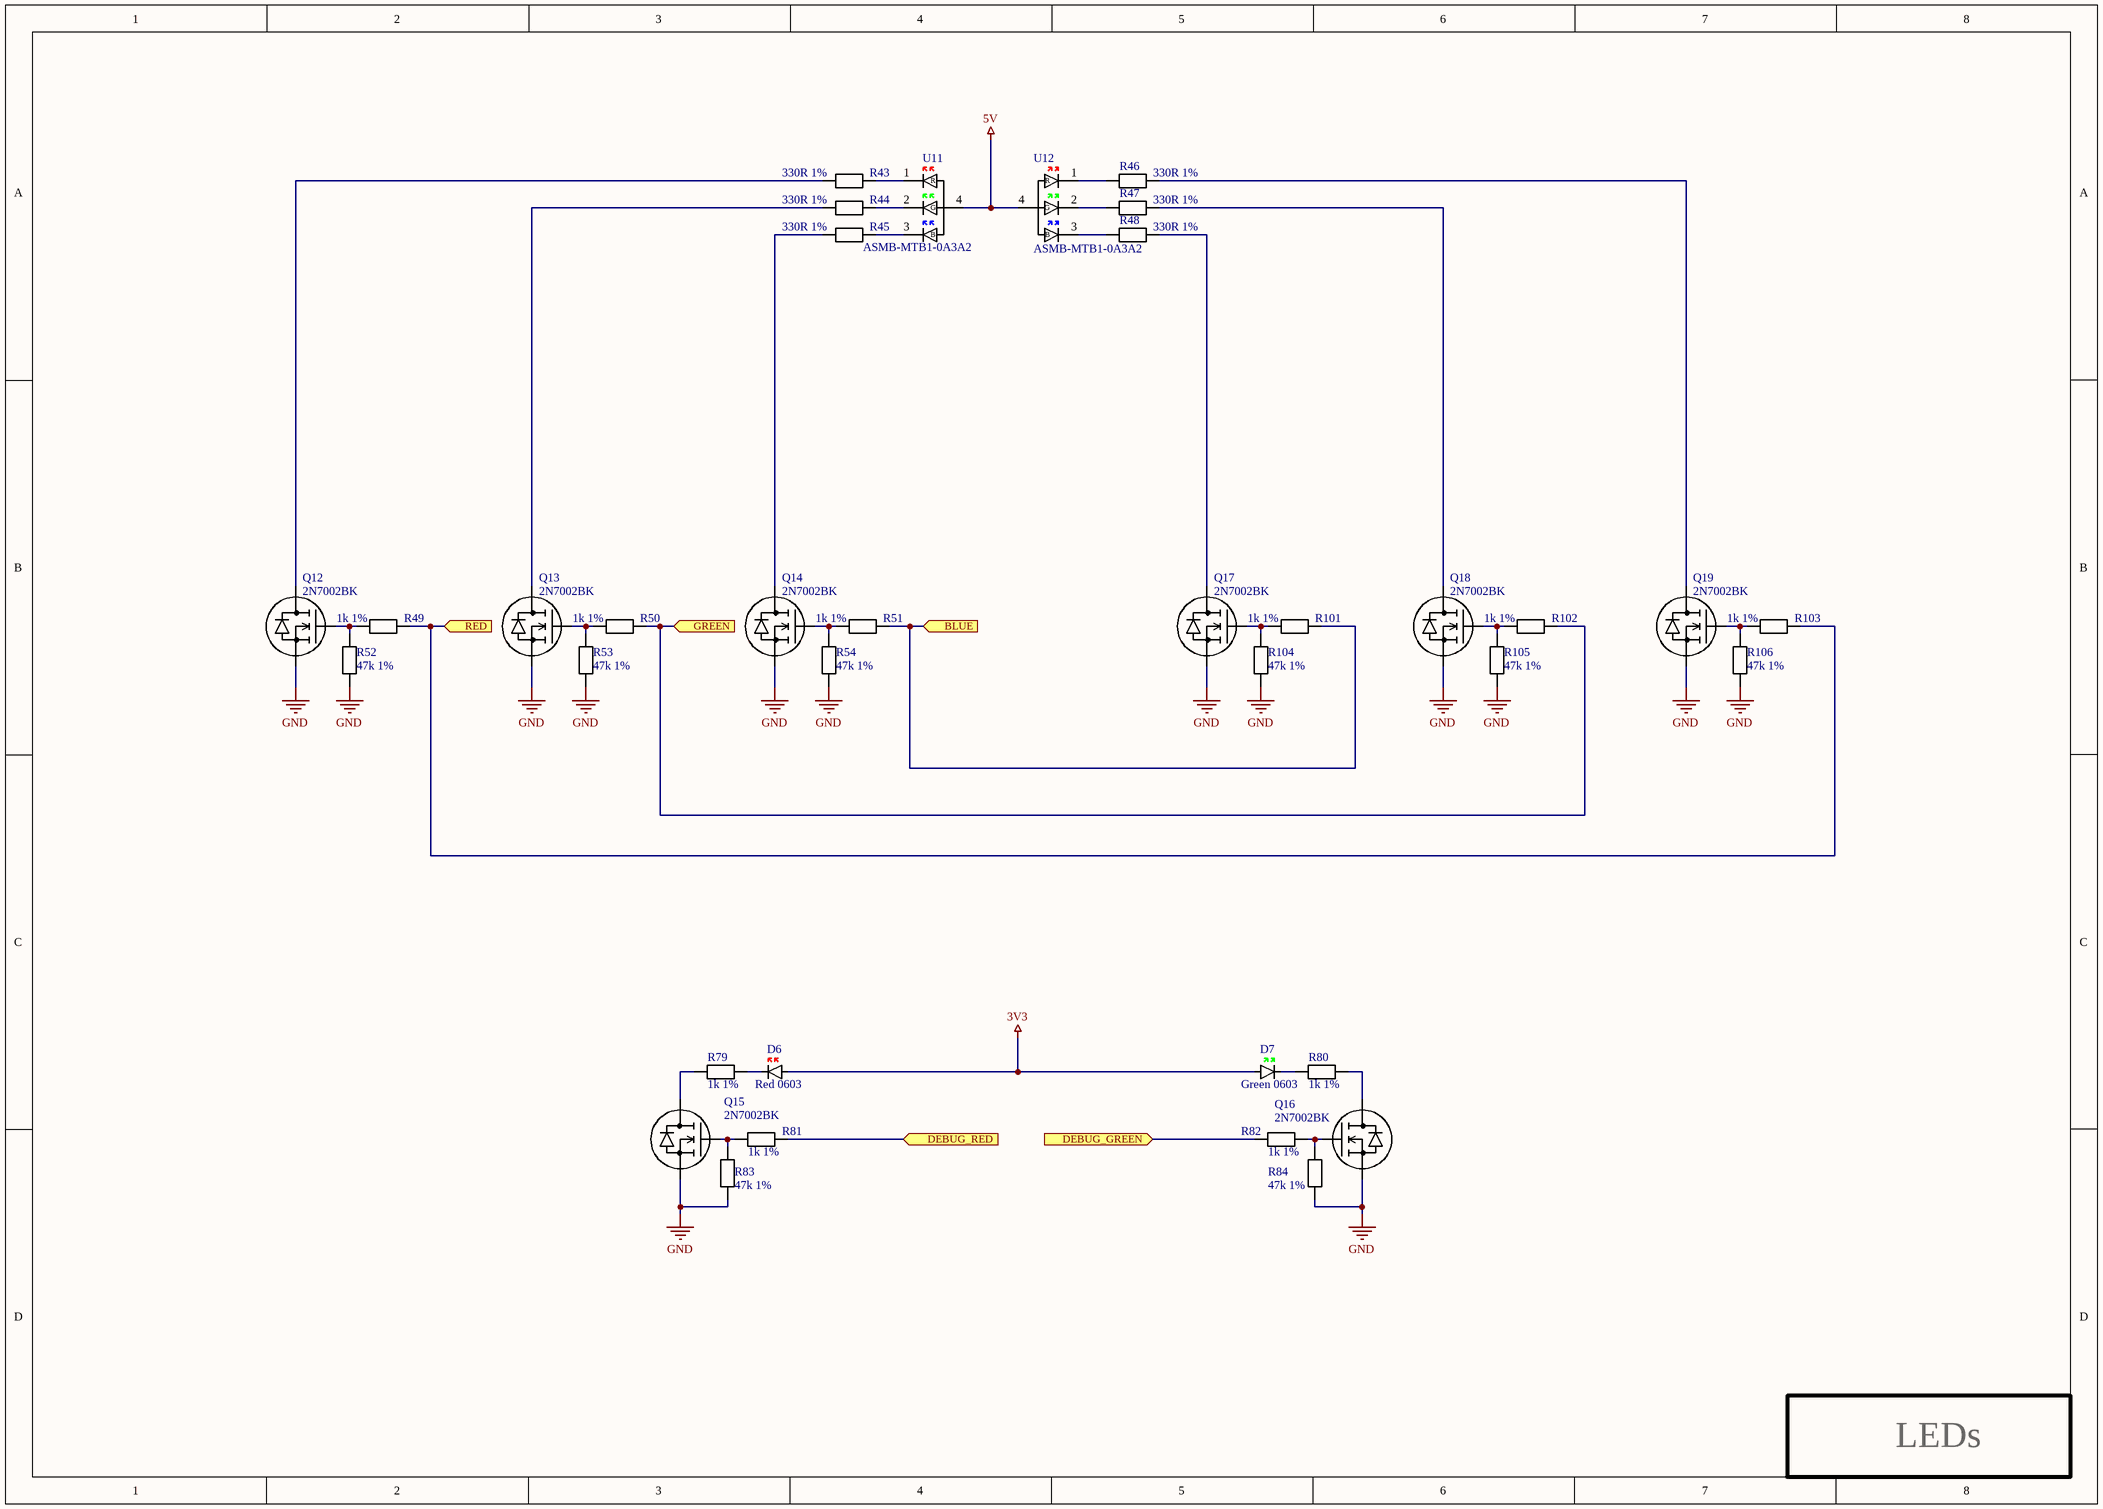
[diagram p5: LEDs.SchDoc]

### Parts
D6  Red 0603  [LED_0603_AUTO]
D7  Green 0603  [LED_0603_AUTO]
Q12  2N7002BK  [SOT23-3_AUTO]
Q13  2N7002BK  [SOT23-3_AUTO]
Q14  2N7002BK  [SOT23-3_AUTO]
Q15  2N7002BK  [SOT23-3_AUTO]
Q16  2N7002BK  [SOT23-3_AUTO]
Q17  2N7002BK  [SOT23-3_AUTO]
Q18  2N7002BK  [SOT23-3_AUTO]
Q19  2N7002BK  [SOT23-3_AUTO]
R43  330R 1%  [R_0603_AUTO]
R44  330R 1%  [R_0603_AUTO]
R45  330R 1%  [R_0603_AUTO]
R46  330R 1%  [R_0603_AUTO]
R47  330R 1%  [R_0603_AUTO]
R48  330R 1%  [R_0603_AUTO]
R49  1k 1%  [R_0603_AUTO]
R50  1k 1%  [R_0603_AUTO]
R51  1k 1%  [R_0603_AUTO]
R52  47k 1%  [R_0603_AUTO]
R53  47k 1%  [R_0603_AUTO]
R54  47k 1%  [R_0603_AUTO]
R79  1k 1%  [R_0603_AUTO]
R80  1k 1%  [R_0603_AUTO]
R81  1k 1%  [R_0603_AUTO]
R82  1k 1%  [R_0603_AUTO]
R83  47k 1%  [R_0603_AUTO]
R84  47k 1%  [R_0603_AUTO]
R101  1k 1%  [R_0603_AUTO]
R102  1k 1%  [R_0603_AUTO]
R103  1k 1%  [R_0603_AUTO]
R104  47k 1%  [R_0603_AUTO]
R105  47k 1%  [R_0603_AUTO]
R106  47k 1%  [R_0603_AUTO]
U11  ASMB-MTB1-0A3A2  [PLCC4]
U12  ASMB-MTB1-0A3A2  [PLCC4]

### Ports
BLUE (in), DEBUG_GREEN (in), DEBUG_RED (in), GREEN (in), RED (in)

### Nets
3V3: D6.2(A) D7.2(A)
5V: U11.4 U12.4
GND: Q12.2(S) Q13.2(S) Q14.2(S) Q15.2(S) Q16.2(S) Q17.2(S) Q18.2(S) Q19.2(S) R52.2 R53.2 R54.2 R83.2 R84.2 R104.2 R105.2 R106.2
DEBUG_GREEN: R82.1 ; port DEBUG_GREEN
DEBUG_RED: R81.2 ; port DEBUG_RED
LED_BLUE: R51.1 R101.1 ; port BLUE
LED_GREEN: R50.1 R102.1 ; port GREEN
LED_RED: R49.1 R103.1 ; port RED
NetD6_1: D6.1(C) R79.1
NetD7_1: D7.1(C) R80.1
NetQ12_1: Q12.1(G) R49.2 R52.1
NetQ12_3: Q12.3(D) R43.2
NetQ13_1: Q13.1(G) R50.2 R53.1
NetQ13_3: Q13.3(D) R44.2
NetQ14_1: Q14.1(G) R51.2 R54.1
NetQ14_3: Q14.3(D) R45.2
NetQ15_1: Q15.1(G) R81.1 R83.1
NetQ15_3: Q15.3(D) R79.2
NetQ16_1: Q16.1(G) R82.2 R84.1
NetQ16_3: Q16.3(D) R80.2
NetQ17_1: Q17.1(G) R101.2 R104.1
NetQ17_3: Q17.3(D) R48.2
NetQ18_1: Q18.1(G) R102.2 R105.1
NetQ18_3: Q18.3(D) R47.2
NetQ19_1: Q19.1(G) R103.2 R106.1
NetQ19_3: Q19.3(D) R46.2
NetR43_1: R43.1 U11.1(R)
NetR44_1: R44.1 U11.2(G)
NetR45_1: R45.1 U11.3(B)
NetR46_1: R46.1 U12.1(R)
NetR47_1: R47.1 U12.2(G)
NetR48_1: R48.1 U12.3(B)

### Notes on the sheet
- LEDs
- Title:
- Project name:
- Last modification:
- Author:
- Version control rev.:
- Sheet:
- /
- Sheet size:
- Variant:
- File name:
- A3
- Altium build:

### Library data of the parts
D6 = LED_Red_0603: Generic Red 0603; MPN: [Generic]; Value: Red; Manufacturer: [Generic]
D7 = LED_Green_0603: Generic Green 0603; Manufacturer: [Generic]; MPN: [Generic]; Value: Green
Q12-Q19 = 2N7002BK: as Q2 on sheet Rangefinders; MPN: 2N7002BK; ComponentLink1Description: Datasheet; ComponentLink1URL: https://assets.nexperia.com/documents/data-sheet/2N7002BK.pdf; Supplier 1: Mouser; Supplier 2: Digi-Key; Supplier Part Number 1: 771-2N7002BK215; Supplier Part Number 2: 1727-4789-2-ND
R43-R54 R79-R84 R101-R106 = Resistor: MPN: [Generic]; Manufacturer: [Generic]
  R43-R48: Value: 330R 1%
  R49-R51 R79-R82 R101-R103: Value: 1k 1%
  R52-R54 R83 R84 R104-R106: Value: 47k 1%
U11 U12 = ASMB-MTB1-0A3A2: LED RGB DIFFUSED 4PLCC SMD; Manufacturer: Broadcom Limited; Value: NA; MPN: ASMB-MTB1-0A3A2; Supplier 1: Farnell; Supplier 2: Mouser; Supplier 3: Digi-Key; Supplier Part Number 1: 2401106RL; Supplier Part Number 2: 630-ASMB-MTB1-0A3A2; Supplier Part Number 3: 516-3280-6-ND; ComponentLink1Description: Product page; ComponentLink1URL: https://www.broadcom.com/products/leds-and-displays/surface-mount-plcc/plcc-4-leds/multi-color/asmb-mtb1-0a3a2#overview

## Nets that join several sheets
3V3: Main (39 pins), Rangefinders (9 pins), Power (7 pins), MotorsDrive (6 pins), LEDs (D6.2 D7.2)
5V: Main (5 pins), Power (9 pins), MotorsDrive (13 pins), VoltageBuffers (C58.2 C59.2 U19.4 U20.4), LEDs (U11.4 U12.4)
BATTERY+: Power (6 pins), MotorsDrive (18 pins)
GND: Main (52 pins), Rangefinders (18 pins), Power (19 pins), MotorsDrive (41 pins), VoltageBuffers (12 pins), LEDs (16 pins)
BAT_STATUS: Main (U1.22), Power (U16.1 U16.4)
CUR_A_1: MotorsDrive (R59.2 U2.10), VoltageBuffers (U19.3)
CUR_A_2: MotorsDrive (R60.2 U2.12), VoltageBuffers (U19.5)
CUR_B_1: MotorsDrive (R61.2 U3.10), VoltageBuffers (U19.10)
CUR_B_2: MotorsDrive (R62.2 U3.12), VoltageBuffers (U19.12)
CUR_C_1: MotorsDrive (R63.2 U4.10), VoltageBuffers (U20.3)
CUR_C_2: MotorsDrive (R64.2 U4.12), VoltageBuffers (U20.5)
CUR_D_1: MotorsDrive (R65.2 U5.10), VoltageBuffers (U20.10)
CUR_D_2: MotorsDrive (R66.2 U5.12), VoltageBuffers (U20.12)
CURRENT_A_1: Main (U1.23), VoltageBuffers (R85.1 R87.2)
CURRENT_A_2: Main (U1.25), VoltageBuffers (R89.1 R91.2)
CURRENT_B_1: Main (U1.26), VoltageBuffers (R93.1 R95.2)
CURRENT_B_2: Main (U1.27), VoltageBuffers (R97.1 R99.2)
CURRENT_C_1: Main (U1.8), VoltageBuffers (R86.1 R88.2)
CURRENT_C_2: Main (U1.9), VoltageBuffers (R90.1 R92.2)
CURRENT_D_1: Main (U1.10), VoltageBuffers (R94.1 R96.2)
CURRENT_D_2: Main (U1.11), VoltageBuffers (R98.1 R100.2)
DEBUG_GREEN: Main (U1.33), LEDs (R82.1)
DEBUG_RED: Main (U1.34), LEDs (R81.2)
DRIVE_CS_A: Main (U1.45), MotorsDrive (U18.6)
DRIVE_CS_B: Main (U1.50), MotorsDrive (U18.7)
DRIVE_CS_C: Main (U1.3), MotorsDrive (U17.4)
DRIVE_CS_D: Main (U1.4), MotorsDrive (U17.5)
DRIVE_IN1_A: Main (U1.14), MotorsDrive (U18.1)
DRIVE_IN1_B: Main (U1.16), MotorsDrive (U18.4)
DRIVE_IN1_C: Main (U1.58), MotorsDrive (U17.6)
DRIVE_IN1_D: Main (U1.61), MotorsDrive (U17.8)
DRIVE_IN2_A: Main (U1.15), MotorsDrive (U18.3)
DRIVE_IN2_B: Main (U1.17), MotorsDrive (U18.5)
DRIVE_IN2_C: Main (U1.59), MotorsDrive (U17.7)
DRIVE_IN2_D: Main (U1.62), MotorsDrive (U17.9)
DRIVE_SCK: Main (U1.55), MotorsDrive (U17.3)
DRIVE_SDI: Main (U1.57), MotorsDrive (U18.9)
DRIVE_SDO: Main (U1.56), MotorsDrive (U18.8)
DRIVE_SLEEP: Main (U1.2), MotorsDrive (U17.1)
LED_BLUE: Main (P4.4 U1.38), LEDs (R51.1 R101.1)
LED_GREEN: Main (P4.5 U1.39), LEDs (R50.1 R102.1)
LED_RED: Main (P4.3 U1.37), LEDs (R49.1 R103.1)
SCL: Main (6 pins), Rangefinders (5 pins)
SDA: Main (6 pins), Rangefinders (5 pins)
SENS_BL_GPIO: Main (U6.5), Rangefinders (R33.1)
SENS_BL_SHDN: Main (U6.24), Rangefinders (R34.1)
SENS_BR_GPIO: Main (U6.7), Rangefinders (R35.1)
SENS_BR_SHDN: Main (U6.23), Rangefinders (R36.1)
SENS_FL_GPIO: Main (U6.6), Rangefinders (R41.1)
SENS_FL_SHDN: Main (U6.20), Rangefinders (R42.1)
SENS_FR_GPIO: Main (U6.9), Rangefinders (R37.1)
SENS_FR_SHDN: Main (U6.19), Rangefinders (R38.1)
SENS_ML_GPIO: Main (U6.8), Rangefinders (R39.1)
SENS_ML_SHDN: Main (U6.21), Rangefinders (R40.1)
SENS_MR_GPIO: Main (U6.4), Rangefinders (R31.1)
SENS_MR_SHDN: Main (U6.22), Rangefinders (R32.1)